# EAGLE design electrosteel2020_10_arrange7_synthboardsonlyrev6 (EAGLE 9.6.2)

## Sheet 1 of 2
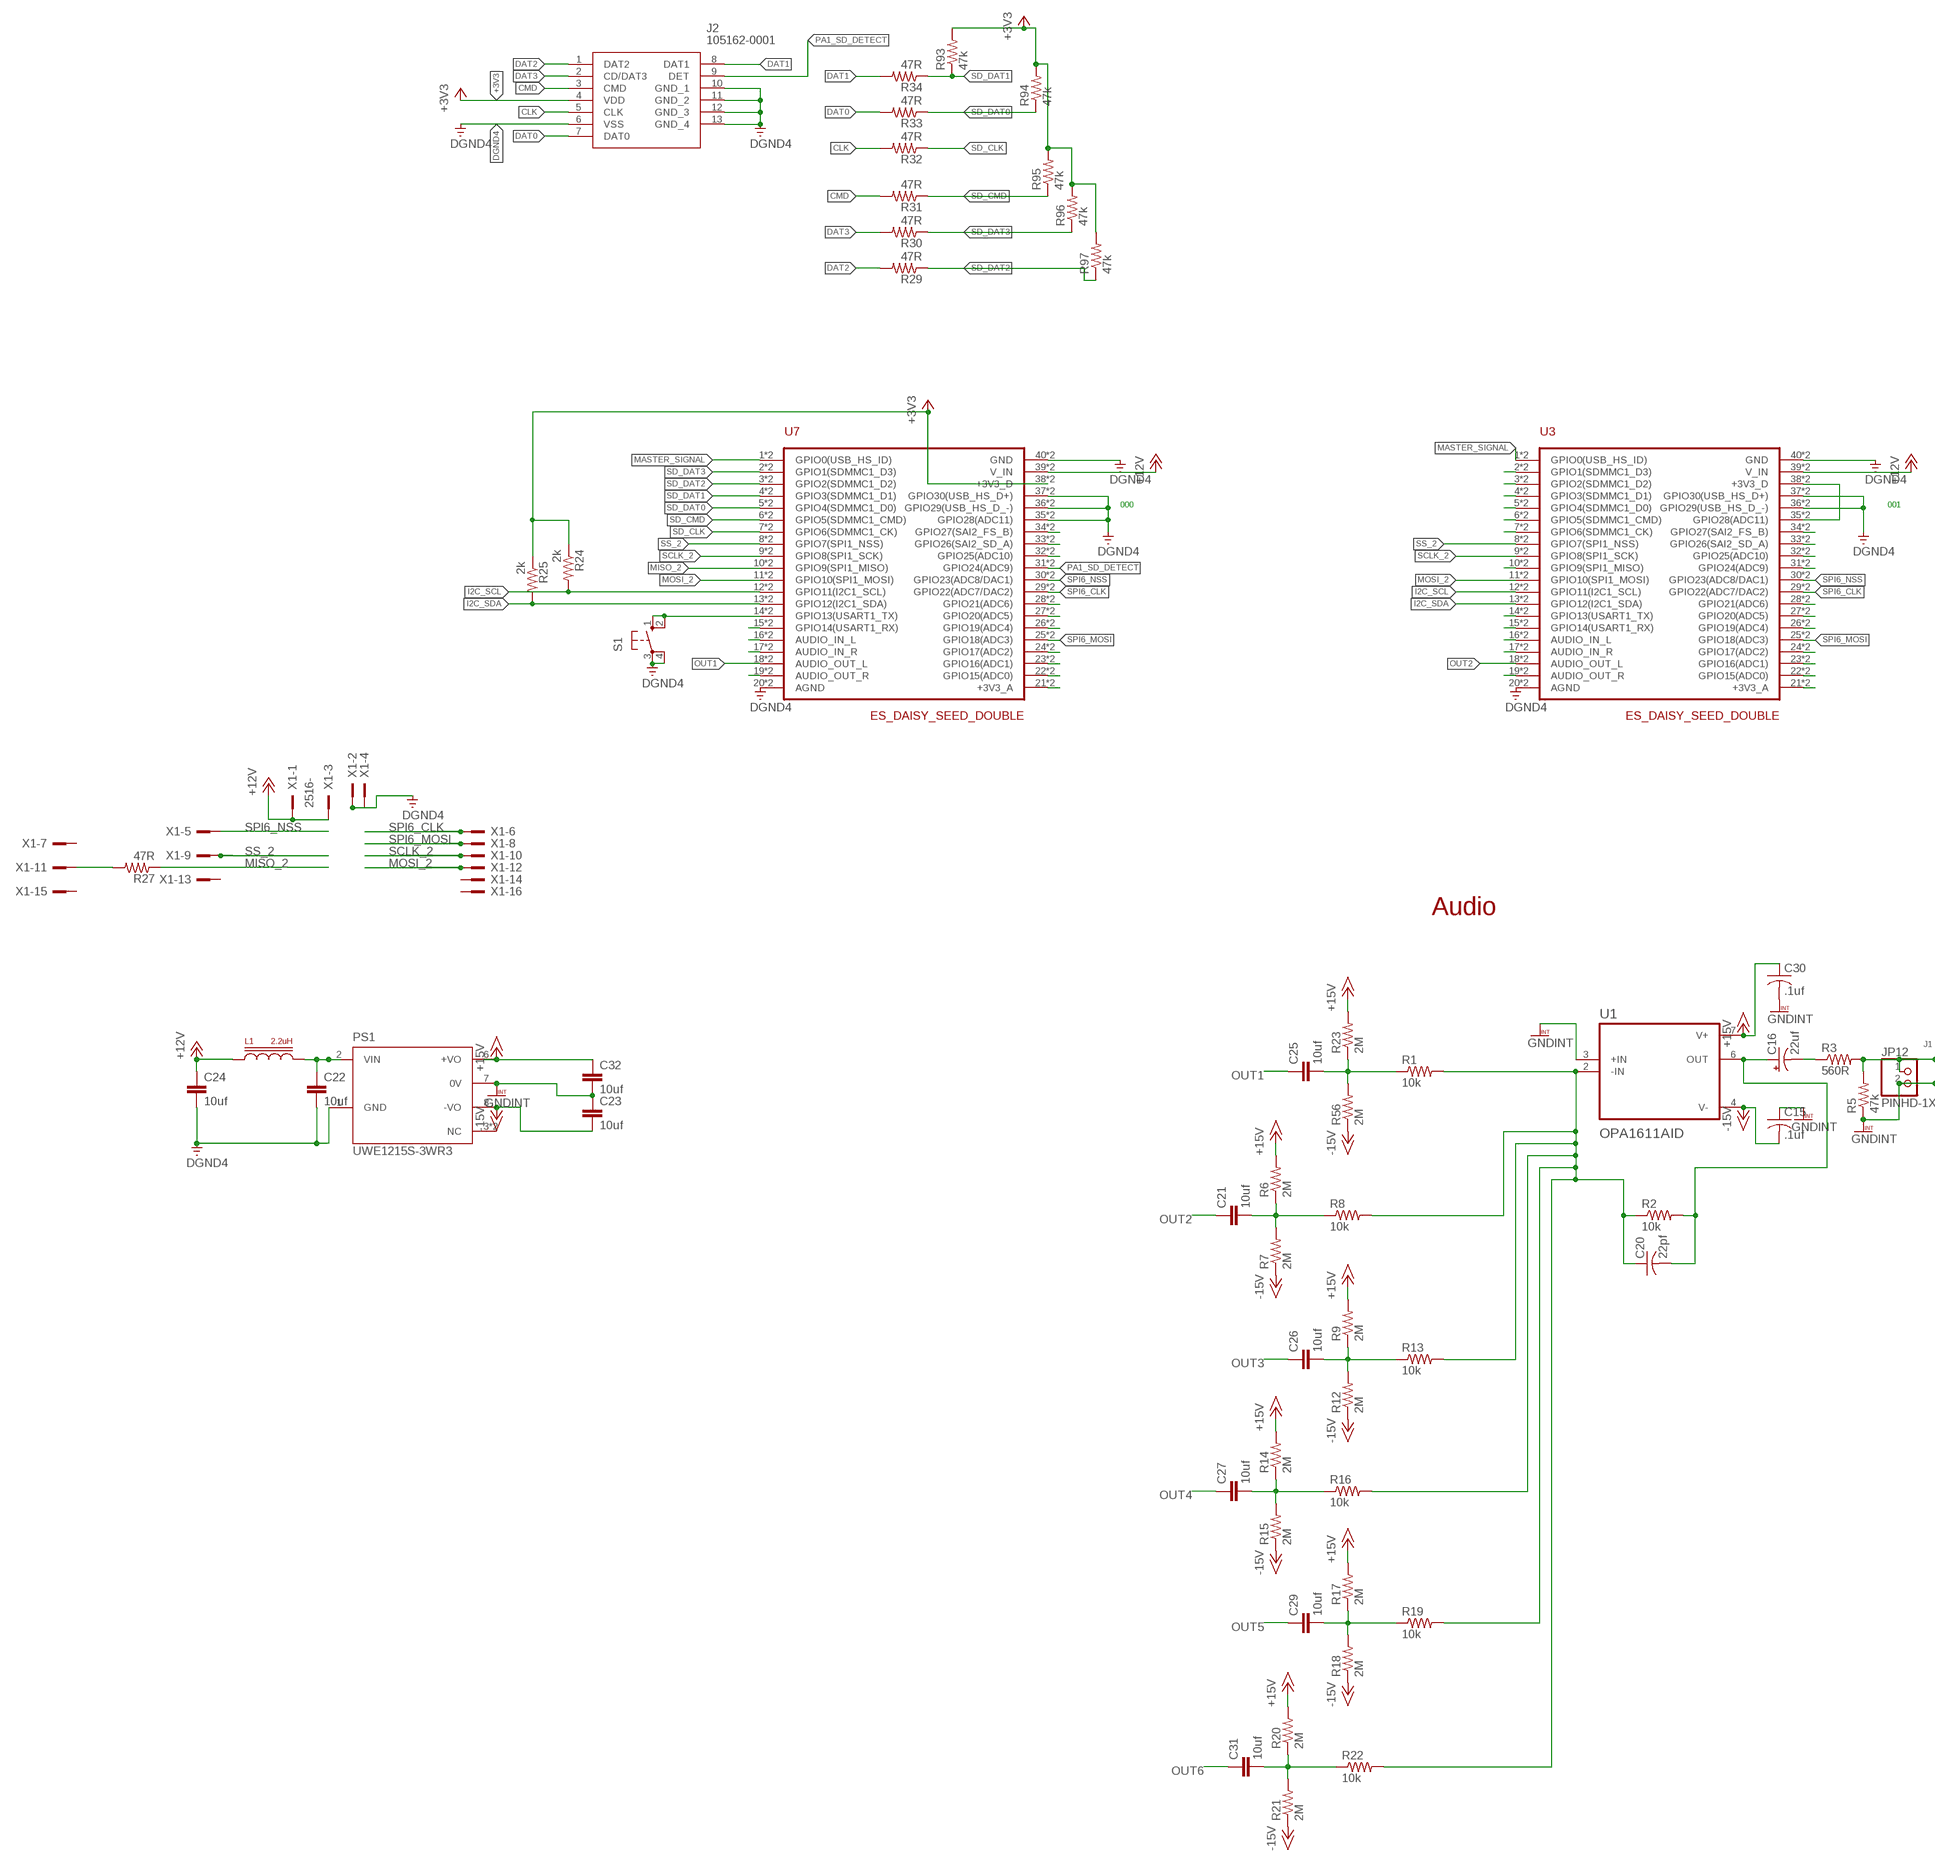
[diagram p0: schematic, sheet 1, part 1 of 3]
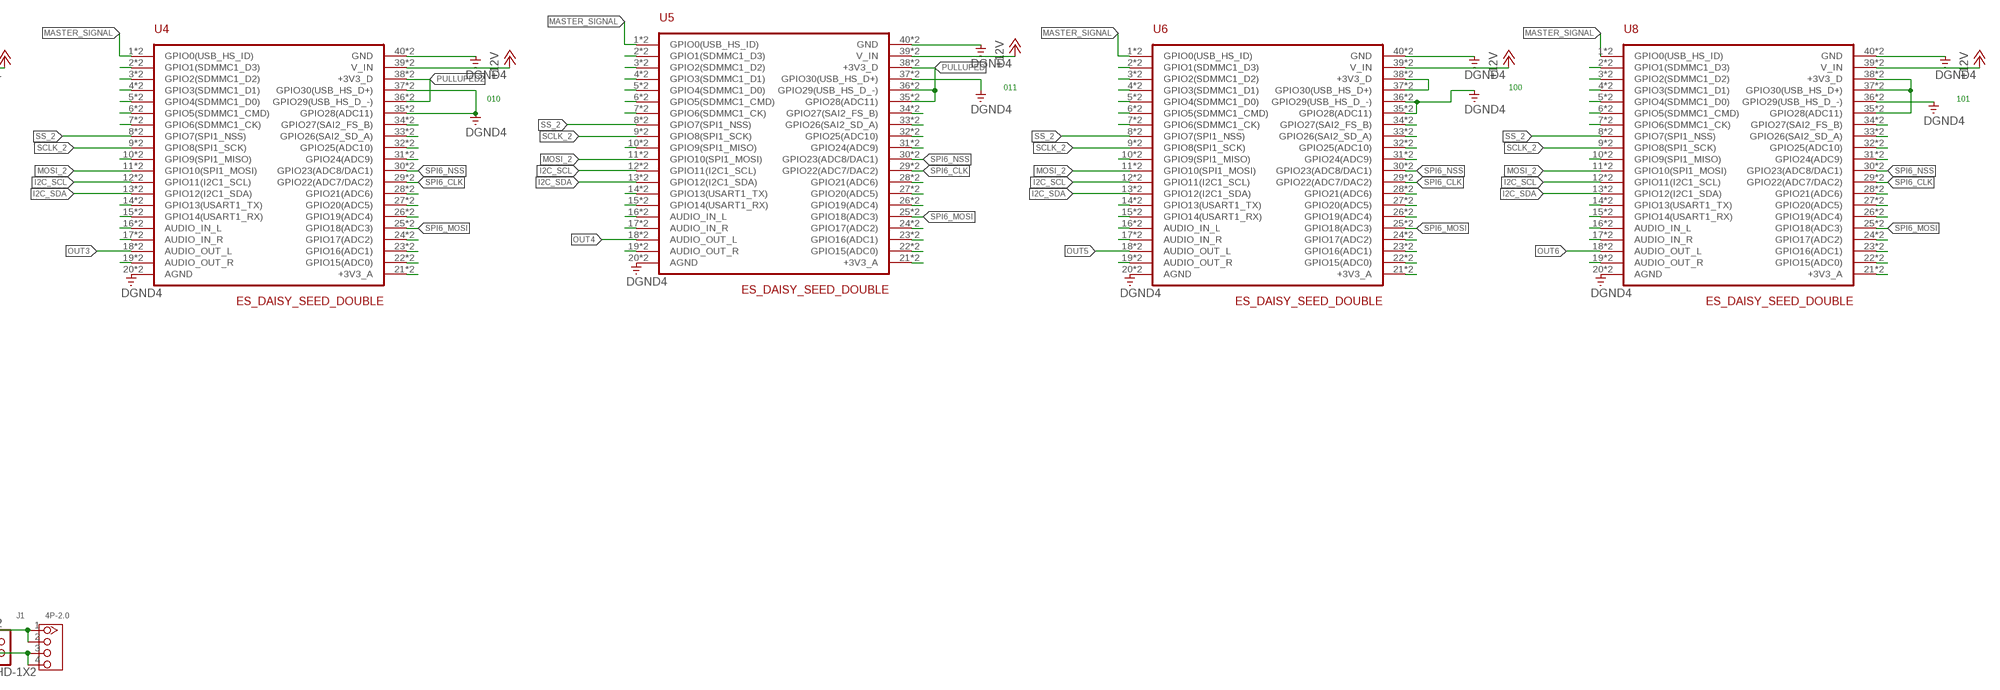
[diagram p1: schematic, sheet 1, part 2 of 3]
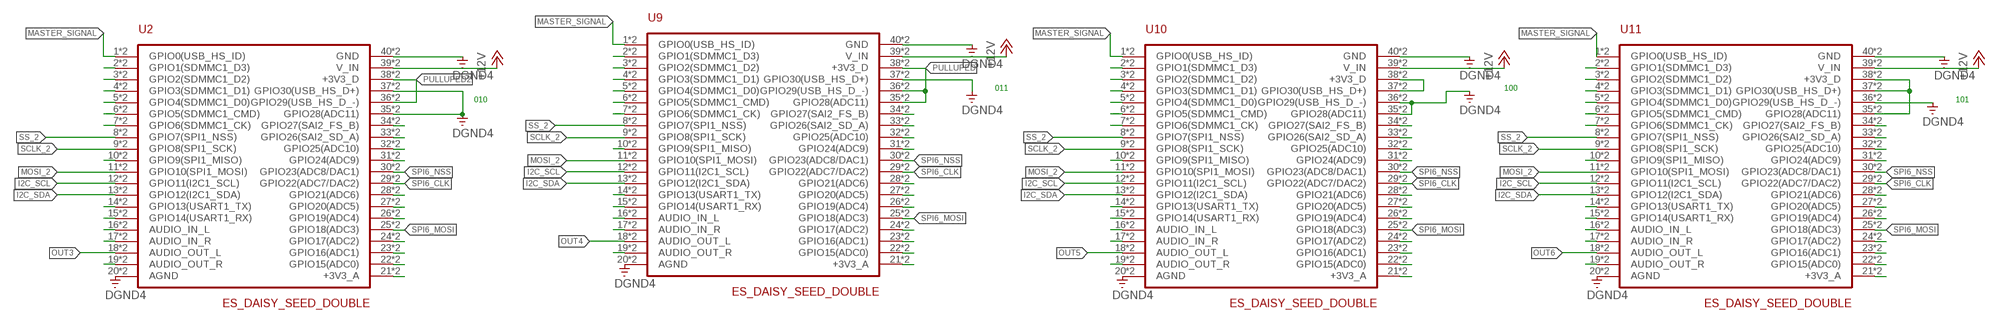
[diagram p2: schematic, sheet 1, part 3 of 3]

### Parts
C15  .1uf  C-USC0603K  [C0603K]
C16  22uf  CPOL-USD  [PANASONIC_D]
C20  22pf  C-USC0603  [C0603]
C21  10uf  C-EUC1206K  [C1206K]
C22  10uf  C-EUC1206K  [C1206K]
C23  10uf  C-EUC1206K  [C1206K]
C24  10uf  C-EUC1206K  [C1206K]
C25  10uf  C-EUC1206K  [C1206K]
C26  10uf  C-EUC1206K  [C1206K]
C27  10uf  C-EUC1206K  [C1206K]
C29  10uf  C-EUC1206K  [C1206K]
C30  .1uf  C-USC0603K  [C0603K]
C31  10uf  C-EUC1206K  [C1206K]
C32  10uf  C-EUC1206K  [C1206K]
J1  4P-2.0  GROVE-CONNECTOR-DIP(4P-2.0)  [HW4-2.0]
J2  105162-0001  [105162-0001]
JP12  PINHD-1X2  [1X02]
L1  2.2uH  INDUCTORS  [BOURNS_SRP2010]
PS1  UWE1215S-3WR3  [CONV_UWE1215S-3WR3]
R1  10k  R-US_R0603  [R0603]
R2  10k  R-US_R0603  [R0603]
R3  560R  R-US_R0603  [R0603]
R5  47k  R-US_R0603  [R0603]
R6  2M  R-US_R0603  [R0603]
R7  2M  R-US_R0603  [R0603]
R8  10k  R-US_R0603  [R0603]
R9  2M  R-US_R0603  [R0603]
R12  2M  R-US_R0603  [R0603]
R13  10k  R-US_R0603  [R0603]
R14  2M  R-US_R0603  [R0603]
R15  2M  R-US_R0603  [R0603]
R16  10k  R-US_R0603  [R0603]
R17  2M  R-US_R0603  [R0603]
R18  2M  R-US_R0603  [R0603]
R19  10k  R-US_R0603  [R0603]
R20  2M  R-US_R0603  [R0603]
R21  2M  R-US_R0603  [R0603]
R22  10k  R-US_R0603  [R0603]
R23  2M  R-US_R0603  [R0603]
R24  2k  R-US_R0603  [R0603]
R25  2k  R-US_R0603  [R0603]
R27  47R  R-US_R0603  [R0603]
R29  47R  R-US_R0603  [R0603]
R30  47R  R-US_R0603  [R0603]
R31  47R  R-US_R0603  [R0603]
R32  47R  R-US_R0603  [R0603]
R33  47R  R-US_R0603  [R0603]
R34  47R  R-US_R0603  [R0603]
R56  2M  R-US_R0603  [R0603]
R93  47k  R-US_R0603  [R0603]
R94  47k  R-US_R0603  [R0603]
R95  47k  R-US_R0603  [R0603]
R96  47k  R-US_R0603  [R0603]
R97  47k  R-US_R0603  [R0603]
S1  10-XX  [B3F-10XX]
U1  OPA1611AID  [SOIC127P599X175-8N]
U2  ES_DAISY_SEED_DOUBLE  [ES_DAISY_SEED_DOUBLE]
U3  ES_DAISY_SEED_DOUBLE  [ES_DAISY_SEED_DOUBLE]
U4  ES_DAISY_SEED_DOUBLE  [ES_DAISY_SEED_DOUBLE]
U5  ES_DAISY_SEED_DOUBLE  [ES_DAISY_SEED_DOUBLE]
U6  ES_DAISY_SEED_DOUBLE  [ES_DAISY_SEED_DOUBLE]
U7  ES_DAISY_SEED_DOUBLE  [ES_DAISY_SEED_DOUBLE]
U8  ES_DAISY_SEED_DOUBLE  [ES_DAISY_SEED_DOUBLE]
U9  ES_DAISY_SEED_DOUBLE  [ES_DAISY_SEED_DOUBLE]
U10  ES_DAISY_SEED_DOUBLE  [ES_DAISY_SEED_DOUBLE]
U11  ES_DAISY_SEED_DOUBLE  [ES_DAISY_SEED_DOUBLE]
X1  2516-  [PAK100/2500-16]

### Nets
+3V3: J2.4(VDD) R24.1 R25.1 R93.2 R94.2 R95.2 R96.2 R97.2 U7.38(+3V3_D) U7.B38(+3V3_D)
+12V: C24.1 L1.P$1 U2.39(V_IN) U2.B39(V_IN) U3.39(V_IN) U3.B39(V_IN) U4.39(V_IN) U4.B39(V_IN) U5.39(V_IN) U5.B39(V_IN) U6.39(V_IN) U6.B39(V_IN) U7.39(V_IN) U7.B39(V_IN) U8.39(V_IN) U8.B39(V_IN) U9.39(V_IN) U9.B39(V_IN) U10.39(V_IN) U10.B39(V_IN) U11.39(V_IN) U11.B39(V_IN) X1.1 X1.3
+15V: C30.1 C32.1 PS1.6(+VO) R6.2 R9.2 R14.2 R17.2 R20.2 R23.2 U1.7(V+)
-15V: C15.2 C23.2 PS1.8(-VO) R7.1 R12.1 R15.1 R18.1 R21.1 R56.1 U1.4(V-)
CLK: J2.5(CLK) R32.2
CMD: J2.3(CMD) R31.2
DAT0: J2.7(DAT0) R33.2
DAT1: J2.8(DAT1) R34.2
DAT2: J2.1(DAT2) R29.2
DAT3: J2.2(CD/DAT3) R30.2
DGND4: C22.2 C24.2 J2.6(VSS) J2.10(GND_1) J2.11(GND_2) J2.12(GND_3) J2.13(GND_4) PS1.1(GND) S1.3(P) S1.4(P1) U2.20(AGND) U2.35(GPIO28(ADC11)) U2.37(GPIO30(USB_HS_D+)) U2.40(GND) U2.B20(AGND) U2.B35(GPIO28(ADC11)) U2.B37(GPIO30(USB_HS_D+)) U2.B40(GND) U3.20(AGND) U3.36(GPIO29(USB_HS_D_-)) U3.37(GPIO30(USB_HS_D+)) U3.40(GND) U3.B20(AGND) U3.B36(GPIO29(USB_HS_D_-)) U3.B37(GPIO30(USB_HS_D+)) U3.B40(GND) U4.20(AGND) U4.35(GPIO28(ADC11)) U4.37(GPIO30(USB_HS_D+)) U4.40(GND) U4.B20(AGND) U4.B35(GPIO28(ADC11)) U4.B37(GPIO30(USB_HS_D+)) U4.B40(GND) U5.20(AGND) U5.37(GPIO30(USB_HS_D+)) U5.40(GND) U5.B20(AGND) U5.B37(GPIO30(USB_HS_D+)) U5.B40(GND) U6.20(AGND) U6.35(GPIO28(ADC11)) U6.36(GPIO29(USB_HS_D_-)) U6.40(GND) U6.B20(AGND) U6.B35(GPIO28(ADC11)) U6.B36(GPIO29(USB_HS_D_-)) U6.B40(GND) U7.20(AGND) U7.35(GPIO28(ADC11)) U7.36(GPIO29(USB_HS_D_-)) U7.37(GPIO30(USB_HS_D+)) U7.40(GND) U7.B20(AGND) U7.B35(GPIO28(ADC11)) U7.B36(GPIO29(USB_HS_D_-)) U7.B37(GPIO30(USB_HS_D+)) U7.B40(GND) U8.20(AGND) U8.36(GPIO29(USB_HS_D_-)) U8.40(GND) U8.B20(AGND) U8.B36(GPIO29(USB_HS_D_-)) U8.B40(GND) U9.20(AGND) U9.37(GPIO30(USB_HS_D+)) U9.40(GND) U9.B20(AGND) U9.B37(GPIO30(USB_HS_D+)) U9.B40(GND) U10.20(AGND) U10.35(GPIO28(ADC11)) U10.36(GPIO29(USB_HS_D_-)) U10.40(GND) U10.B20(AGND) U10.B35(GPIO28(ADC11)) U10.B36(GPIO29(USB_HS_D_-)) U10.B40(GND) U11.20(AGND) U11.36(GPIO29(USB_HS_D_-)) U11.40(GND) U11.B20(AGND) U11.B36(GPIO29(USB_HS_D_-)) U11.B40(GND) X1.2 X1.4
GNDINT: C15.1 C23.1 C30.2 C32.2 J1.3 J1.4 JP12.2 PS1.7(0V) R5.1 U1.3(+IN)
I2C_SCL: R24.2 U2.12(GPIO11(I2C1_SCL)) U2.B12(GPIO11(I2C1_SCL)) U3.12(GPIO11(I2C1_SCL)) U3.B12(GPIO11(I2C1_SCL)) U4.12(GPIO11(I2C1_SCL)) U4.B12(GPIO11(I2C1_SCL)) U5.12(GPIO11(I2C1_SCL)) U5.B12(GPIO11(I2C1_SCL)) U6.12(GPIO11(I2C1_SCL)) U6.B12(GPIO11(I2C1_SCL)) U7.12(GPIO11(I2C1_SCL)) U7.B12(GPIO11(I2C1_SCL)) U8.12(GPIO11(I2C1_SCL)) U8.B12(GPIO11(I2C1_SCL)) U9.12(GPIO11(I2C1_SCL)) U9.B12(GPIO11(I2C1_SCL)) U10.12(GPIO11(I2C1_SCL)) U10.B12(GPIO11(I2C1_SCL)) U11.12(GPIO11(I2C1_SCL)) U11.B12(GPIO11(I2C1_SCL))
I2C_SDA: R25.2 U2.13(GPIO12(I2C1_SDA)) U2.B13(GPIO12(I2C1_SDA)) U3.13(GPIO12(I2C1_SDA)) U3.B13(GPIO12(I2C1_SDA)) U4.13(GPIO12(I2C1_SDA)) U4.B13(GPIO12(I2C1_SDA)) U5.13(GPIO12(I2C1_SDA)) U5.B13(GPIO12(I2C1_SDA)) U6.13(GPIO12(I2C1_SDA)) U6.B13(GPIO12(I2C1_SDA)) U7.13(GPIO12(I2C1_SDA)) U7.B13(GPIO12(I2C1_SDA)) U8.13(GPIO12(I2C1_SDA)) U8.B13(GPIO12(I2C1_SDA)) U9.13(GPIO12(I2C1_SDA)) U9.B13(GPIO12(I2C1_SDA)) U10.13(GPIO12(I2C1_SDA)) U10.B13(GPIO12(I2C1_SDA)) U11.13(GPIO12(I2C1_SDA)) U11.B13(GPIO12(I2C1_SDA))
MASTER_SIGNAL: U2.1(GPIO0(USB_HS_ID)) U2.B1(GPIO0(USB_HS_ID)) U3.1(GPIO0(USB_HS_ID)) U3.B1(GPIO0(USB_HS_ID)) U4.1(GPIO0(USB_HS_ID)) U4.B1(GPIO0(USB_HS_ID)) U5.1(GPIO0(USB_HS_ID)) U5.B1(GPIO0(USB_HS_ID)) U6.1(GPIO0(USB_HS_ID)) U6.B1(GPIO0(USB_HS_ID)) U7.1(GPIO0(USB_HS_ID)) U7.B1(GPIO0(USB_HS_ID)) U8.1(GPIO0(USB_HS_ID)) U8.B1(GPIO0(USB_HS_ID)) U9.1(GPIO0(USB_HS_ID)) U9.B1(GPIO0(USB_HS_ID)) U10.1(GPIO0(USB_HS_ID)) U10.B1(GPIO0(USB_HS_ID)) U11.1(GPIO0(USB_HS_ID)) U11.B1(GPIO0(USB_HS_ID))
MISO_2: R27.1 U7.10(GPIO9(SPI1_MISO)) U7.B10(GPIO9(SPI1_MISO))
MISO_2_P1: U3.10(GPIO9(SPI1_MISO)) U3.B10(GPIO9(SPI1_MISO))
MISO_2_P2: U4.10(GPIO9(SPI1_MISO)) U4.B10(GPIO9(SPI1_MISO))
MISO_2_P3: U5.10(GPIO9(SPI1_MISO)) U5.B10(GPIO9(SPI1_MISO))
MISO_2_P4: U6.10(GPIO9(SPI1_MISO)) U6.B10(GPIO9(SPI1_MISO))
MISO_2_P5: U8.10(GPIO9(SPI1_MISO)) U8.B10(GPIO9(SPI1_MISO))
MISO_2_P6: U2.10(GPIO9(SPI1_MISO)) U2.B10(GPIO9(SPI1_MISO))
MISO_2_P7: U9.10(GPIO9(SPI1_MISO)) U9.B10(GPIO9(SPI1_MISO))
MISO_2_P8: U10.10(GPIO9(SPI1_MISO)) U10.B10(GPIO9(SPI1_MISO))
MISO_2_P9: U11.10(GPIO9(SPI1_MISO)) U11.B10(GPIO9(SPI1_MISO))
MONO_OUTPUT: C16.+ C20.2 R2.2 U1.6(OUT)
MOSI_2: U2.11(GPIO10(SPI1_MOSI)) U2.B11(GPIO10(SPI1_MOSI)) U3.11(GPIO10(SPI1_MOSI)) U3.B11(GPIO10(SPI1_MOSI)) U4.11(GPIO10(SPI1_MOSI)) U4.B11(GPIO10(SPI1_MOSI)) U5.11(GPIO10(SPI1_MOSI)) U5.B11(GPIO10(SPI1_MOSI)) U6.11(GPIO10(SPI1_MOSI)) U6.B11(GPIO10(SPI1_MOSI)) U7.11(GPIO10(SPI1_MOSI)) U7.B11(GPIO10(SPI1_MOSI)) U8.11(GPIO10(SPI1_MOSI)) U8.B11(GPIO10(SPI1_MOSI)) U9.11(GPIO10(SPI1_MOSI)) U9.B11(GPIO10(SPI1_MOSI)) U10.11(GPIO10(SPI1_MOSI)) U10.B11(GPIO10(SPI1_MOSI)) U11.11(GPIO10(SPI1_MOSI)) U11.B11(GPIO10(SPI1_MOSI)) X1.12
N$1: U5.31(GPIO24(ADC9)) U5.B31(GPIO24(ADC9))
N$2: C21.2 R6.1 R7.2 R8.1
N$3: U6.31(GPIO24(ADC9)) U6.B31(GPIO24(ADC9))
N$4: C20.1 R1.2 R2.1 R8.2 R13.2 R16.2 R19.2 R22.2 U1.2(-IN)
N$5: C16.- R3.1
N$6: J1.1 J1.2 JP12.1 R3.2 R5.2
N$7: C25.2 R1.1 R23.1 R56.2
N$8: C26.2 R9.1 R12.2 R13.1
N$9: C27.2 R14.1 R15.2 R16.1
N$10: C29.2 R17.1 R18.2 R19.1
N$11: C31.2 R20.1 R21.2 R22.1
N$12: U7.19(AUDIO_OUT_R) U7.B19(AUDIO_OUT_R)
N$13: U7.17(AUDIO_IN_R) U7.B17(AUDIO_IN_R)
N$14: U7.16(AUDIO_IN_L) U7.B16(AUDIO_IN_L)
N$15: U7.15(GPIO14(USART1_RX)) U7.B15(GPIO14(USART1_RX))
N$16: U2.21(+3V3_A) U2.B21(+3V3_A)
N$17: U8.31(GPIO24(ADC9)) U8.B31(GPIO24(ADC9))
N$18: U8.26(GPIO19(ADC4)) U8.B26(GPIO19(ADC4))
N$19: U6.26(GPIO19(ADC4)) U6.B26(GPIO19(ADC4))
N$20: U7.34(GPIO27(SAI2_FS_B)) U7.B34(GPIO27(SAI2_FS_B))
N$21: U7.33(GPIO26(SAI2_SD_A)) U7.B33(GPIO26(SAI2_SD_A))
N$22: U7.32(GPIO25(ADC10)) U7.B32(GPIO25(ADC10))
N$23: U5.26(GPIO19(ADC4)) U5.B26(GPIO19(ADC4))
N$24: R27.2 X1.11
N$25: U7.28(GPIO21(ADC6)) U7.B28(GPIO21(ADC6))
N$26: U7.27(GPIO20(ADC5)) U7.B27(GPIO20(ADC5))
N$27: U4.26(GPIO19(ADC4)) U4.B26(GPIO19(ADC4))
N$28: U3.26(GPIO19(ADC4)) U3.B26(GPIO19(ADC4))
N$29: U3.21(+3V3_A) U3.B21(+3V3_A)
N$30: U7.24(GPIO17(ADC2)) U7.B24(GPIO17(ADC2))
N$31: U7.23(GPIO16(ADC1)) U7.B23(GPIO16(ADC1))
N$32: U7.22(GPIO15(ADC0)) U7.B22(GPIO15(ADC0))
N$33: U3.19(AUDIO_OUT_R) U3.B19(AUDIO_OUT_R)
N$34: U3.17(AUDIO_IN_R) U3.B17(AUDIO_IN_R)
N$35: U3.16(AUDIO_IN_L) U3.B16(AUDIO_IN_L)
N$36: U3.15(GPIO14(USART1_RX)) U3.B15(GPIO14(USART1_RX))
N$37: U3.14(GPIO13(USART1_TX)) U3.B14(GPIO13(USART1_TX))
N$38: U7.26(GPIO19(ADC4)) U7.B26(GPIO19(ADC4))
N$39: U3.35(GPIO28(ADC11)) U3.38(+3V3_D) U3.B35(GPIO28(ADC11)) U3.B38(+3V3_D)
N$40: U3.34(GPIO27(SAI2_FS_B)) U3.B34(GPIO27(SAI2_FS_B))
N$41: U3.33(GPIO26(SAI2_SD_A)) U3.B33(GPIO26(SAI2_SD_A))
N$42: U3.32(GPIO25(ADC10)) U3.B32(GPIO25(ADC10))
N$43: U3.28(GPIO21(ADC6)) U3.B28(GPIO21(ADC6))
N$44: U3.27(GPIO20(ADC5)) U3.B27(GPIO20(ADC5))
N$45: U7.21(+3V3_A) U7.B21(+3V3_A)
N$46: U3.24(GPIO17(ADC2)) U3.B24(GPIO17(ADC2))
N$47: U3.23(GPIO16(ADC1)) U3.B23(GPIO16(ADC1))
N$48: U3.22(GPIO15(ADC0)) U3.B22(GPIO15(ADC0))
N$49: U4.21(+3V3_A) U4.B21(+3V3_A)
N$50: U4.19(AUDIO_OUT_R) U4.B19(AUDIO_OUT_R)
N$51: U4.17(AUDIO_IN_R) U4.B17(AUDIO_IN_R)
N$52: U4.16(AUDIO_IN_L) U4.B16(AUDIO_IN_L)
N$53: U4.15(GPIO14(USART1_RX)) U4.B15(GPIO14(USART1_RX))
N$54: U4.14(GPIO13(USART1_TX)) U4.B14(GPIO13(USART1_TX))
N$55: S1.1(S) S1.2(S1) U7.14(GPIO13(USART1_TX)) U7.B14(GPIO13(USART1_TX))
N$56: U3.2(GPIO1(SDMMC1_D3)) U3.B2(GPIO1(SDMMC1_D3))
N$57: U4.34(GPIO27(SAI2_FS_B)) U4.B34(GPIO27(SAI2_FS_B))
N$58: U4.33(GPIO26(SAI2_SD_A)) U4.B33(GPIO26(SAI2_SD_A))
N$59: U4.32(GPIO25(ADC10)) U4.B32(GPIO25(ADC10))
N$60: U4.28(GPIO21(ADC6)) U4.B28(GPIO21(ADC6))
N$61: U4.27(GPIO20(ADC5)) U4.B27(GPIO20(ADC5))
N$62: U4.24(GPIO17(ADC2)) U4.B24(GPIO17(ADC2))
N$63: U4.23(GPIO16(ADC1)) U4.B23(GPIO16(ADC1))
N$64: U4.22(GPIO15(ADC0)) U4.B22(GPIO15(ADC0))
N$65: U5.21(+3V3_A) U5.B21(+3V3_A)
N$66: U5.19(AUDIO_OUT_R) U5.B19(AUDIO_OUT_R)
N$67: U5.17(AUDIO_IN_R) U5.B17(AUDIO_IN_R)
N$68: U5.16(AUDIO_IN_L) U5.B16(AUDIO_IN_L)
N$69: U5.15(GPIO14(USART1_RX)) U5.B15(GPIO14(USART1_RX))
N$70: U5.14(GPIO13(USART1_TX)) U5.B14(GPIO13(USART1_TX))
N$71: U3.3(GPIO2(SDMMC1_D2)) U3.B3(GPIO2(SDMMC1_D2))
N$72: U3.4(GPIO3(SDMMC1_D1)) U3.B4(GPIO3(SDMMC1_D1))
N$73: U5.34(GPIO27(SAI2_FS_B)) U5.B34(GPIO27(SAI2_FS_B))
N$74: U5.33(GPIO26(SAI2_SD_A)) U5.B33(GPIO26(SAI2_SD_A))
N$75: U5.32(GPIO25(ADC10)) U5.B32(GPIO25(ADC10))
N$76: U5.28(GPIO21(ADC6)) U5.B28(GPIO21(ADC6))
N$77: U5.27(GPIO20(ADC5)) U5.B27(GPIO20(ADC5))
N$78: U5.24(GPIO17(ADC2)) U5.B24(GPIO17(ADC2))
N$79: U5.23(GPIO16(ADC1)) U5.B23(GPIO16(ADC1))
N$80: U5.22(GPIO15(ADC0)) U5.B22(GPIO15(ADC0))
N$81: C22.1 L1.P$2 PS1.2(VIN)
N$82: U6.21(+3V3_A) U6.B21(+3V3_A)
N$83: U6.19(AUDIO_OUT_R) U6.B19(AUDIO_OUT_R)
N$84: U6.17(AUDIO_IN_R) U6.B17(AUDIO_IN_R)
N$85: U6.16(AUDIO_IN_L) U6.B16(AUDIO_IN_L)
N$86: U6.15(GPIO14(USART1_RX)) U6.B15(GPIO14(USART1_RX))
N$87: U6.14(GPIO13(USART1_TX)) U6.B14(GPIO13(USART1_TX))
N$88: U6.37(GPIO30(USB_HS_D+)) U6.38(+3V3_D) U6.B37(GPIO30(USB_HS_D+)) U6.B38(+3V3_D)
N$89: U3.5(GPIO4(SDMMC1_D0)) U3.B5(GPIO4(SDMMC1_D0))
N$90: U6.34(GPIO27(SAI2_FS_B)) U6.B34(GPIO27(SAI2_FS_B))
N$91: U6.33(GPIO26(SAI2_SD_A)) U6.B33(GPIO26(SAI2_SD_A))
N$92: U6.32(GPIO25(ADC10)) U6.B32(GPIO25(ADC10))
N$93: U6.28(GPIO21(ADC6)) U6.B28(GPIO21(ADC6))
N$94: U6.27(GPIO20(ADC5)) U6.B27(GPIO20(ADC5))
N$95: U6.24(GPIO17(ADC2)) U6.B24(GPIO17(ADC2))
N$96: U6.23(GPIO16(ADC1)) U6.B23(GPIO16(ADC1))
N$97: U6.22(GPIO15(ADC0)) U6.B22(GPIO15(ADC0))
N$98: U8.21(+3V3_A) U8.B21(+3V3_A)
N$99: U8.19(AUDIO_OUT_R) U8.B19(AUDIO_OUT_R)
N$100: U8.17(AUDIO_IN_R) U8.B17(AUDIO_IN_R)
N$101: U8.16(AUDIO_IN_L) U8.B16(AUDIO_IN_L)
N$102: U8.15(GPIO14(USART1_RX)) U8.B15(GPIO14(USART1_RX))
N$103: U8.14(GPIO13(USART1_TX)) U8.B14(GPIO13(USART1_TX))
N$104: U8.35(GPIO28(ADC11)) U8.37(GPIO30(USB_HS_D+)) U8.38(+3V3_D) U8.B35(GPIO28(ADC11)) U8.B37(GPIO30(USB_HS_D+)) U8.B38(+3V3_D)
N$105: U3.6(GPIO5(SDMMC1_CMD)) U3.B6(GPIO5(SDMMC1_CMD))
N$106: U3.7(GPIO6(SDMMC1_CK)) U3.B7(GPIO6(SDMMC1_CK))
N$107: U2.19(AUDIO_OUT_R) U2.B19(AUDIO_OUT_R)
N$108: U8.34(GPIO27(SAI2_FS_B)) U8.B34(GPIO27(SAI2_FS_B))
N$109: U8.33(GPIO26(SAI2_SD_A)) U8.B33(GPIO26(SAI2_SD_A))
N$110: U8.32(GPIO25(ADC10)) U8.B32(GPIO25(ADC10))
N$111: U8.28(GPIO21(ADC6)) U8.B28(GPIO21(ADC6))
N$112: U8.27(GPIO20(ADC5)) U8.B27(GPIO20(ADC5))
N$113: U8.24(GPIO17(ADC2)) U8.B24(GPIO17(ADC2))
N$114: U8.23(GPIO16(ADC1)) U8.B23(GPIO16(ADC1))
N$115: U8.22(GPIO15(ADC0)) U8.B22(GPIO15(ADC0))
N$116: U4.2(GPIO1(SDMMC1_D3)) U4.B2(GPIO1(SDMMC1_D3))
N$117: U4.3(GPIO2(SDMMC1_D2)) U4.B3(GPIO2(SDMMC1_D2))
N$118: U4.4(GPIO3(SDMMC1_D1)) U4.B4(GPIO3(SDMMC1_D1))
N$119: U4.5(GPIO4(SDMMC1_D0)) U4.B5(GPIO4(SDMMC1_D0))
N$120: U4.6(GPIO5(SDMMC1_CMD)) U4.B6(GPIO5(SDMMC1_CMD))
N$121: U4.7(GPIO6(SDMMC1_CK)) U4.B7(GPIO6(SDMMC1_CK))
N$122: U2.17(AUDIO_IN_R) U2.B17(AUDIO_IN_R)
N$123: U5.2(GPIO1(SDMMC1_D3)) U5.B2(GPIO1(SDMMC1_D3))
N$124: U5.3(GPIO2(SDMMC1_D2)) U5.B3(GPIO2(SDMMC1_D2))
N$125: U5.4(GPIO3(SDMMC1_D1)) U5.B4(GPIO3(SDMMC1_D1))
N$126: U5.5(GPIO4(SDMMC1_D0)) U5.B5(GPIO4(SDMMC1_D0))
N$127: U5.6(GPIO5(SDMMC1_CMD)) U5.B6(GPIO5(SDMMC1_CMD))
N$128: U5.7(GPIO6(SDMMC1_CK)) U5.B7(GPIO6(SDMMC1_CK))
N$129: U2.16(AUDIO_IN_L) U2.B16(AUDIO_IN_L)
N$130: U6.2(GPIO1(SDMMC1_D3)) U6.B2(GPIO1(SDMMC1_D3))
N$131: U6.3(GPIO2(SDMMC1_D2)) U6.B3(GPIO2(SDMMC1_D2))
N$132: U6.4(GPIO3(SDMMC1_D1)) U6.B4(GPIO3(SDMMC1_D1))
N$133: U6.5(GPIO4(SDMMC1_D0)) U6.B5(GPIO4(SDMMC1_D0))
N$134: U6.6(GPIO5(SDMMC1_CMD)) U6.B6(GPIO5(SDMMC1_CMD))
N$135: U6.7(GPIO6(SDMMC1_CK)) U6.B7(GPIO6(SDMMC1_CK))
N$136: U8.2(GPIO1(SDMMC1_D3)) U8.B2(GPIO1(SDMMC1_D3))
N$137: U8.3(GPIO2(SDMMC1_D2)) U8.B3(GPIO2(SDMMC1_D2))
N$138: U8.4(GPIO3(SDMMC1_D1)) U8.B4(GPIO3(SDMMC1_D1))
N$139: U8.5(GPIO4(SDMMC1_D0)) U8.B5(GPIO4(SDMMC1_D0))
N$140: U8.6(GPIO5(SDMMC1_CMD)) U8.B6(GPIO5(SDMMC1_CMD))
N$141: U8.7(GPIO6(SDMMC1_CK)) U8.B7(GPIO6(SDMMC1_CK))
N$142: U2.15(GPIO14(USART1_RX)) U2.B15(GPIO14(USART1_RX))
N$143: U2.14(GPIO13(USART1_TX)) U2.B14(GPIO13(USART1_TX))
N$144: U2.34(GPIO27(SAI2_FS_B)) U2.B34(GPIO27(SAI2_FS_B))
N$145: U2.33(GPIO26(SAI2_SD_A)) U2.B33(GPIO26(SAI2_SD_A))
N$146: U2.32(GPIO25(ADC10)) U2.B32(GPIO25(ADC10))
N$147: U2.28(GPIO21(ADC6)) U2.B28(GPIO21(ADC6))
N$148: U2.27(GPIO20(ADC5)) U2.B27(GPIO20(ADC5))
N$149: U2.24(GPIO17(ADC2)) U2.B24(GPIO17(ADC2))
N$150: U2.23(GPIO16(ADC1)) U2.B23(GPIO16(ADC1))
N$151: U2.22(GPIO15(ADC0)) U2.B22(GPIO15(ADC0))
N$152: U9.21(+3V3_A) U9.B21(+3V3_A)
N$153: U9.19(AUDIO_OUT_R) U9.B19(AUDIO_OUT_R)
N$154: U9.17(AUDIO_IN_R) U9.B17(AUDIO_IN_R)
N$155: U9.16(AUDIO_IN_L) U9.B16(AUDIO_IN_L)
N$156: U9.15(GPIO14(USART1_RX)) U9.B15(GPIO14(USART1_RX))
N$157: U9.14(GPIO13(USART1_TX)) U9.B14(GPIO13(USART1_TX))
N$158: U9.34(GPIO27(SAI2_FS_B)) U9.B34(GPIO27(SAI2_FS_B))
N$159: U9.33(GPIO26(SAI2_SD_A)) U9.B33(GPIO26(SAI2_SD_A))
N$160: U9.32(GPIO25(ADC10)) U9.B32(GPIO25(ADC10))
N$161: U9.28(GPIO21(ADC6)) U9.B28(GPIO21(ADC6))
N$162: U9.27(GPIO20(ADC5)) U9.B27(GPIO20(ADC5))
N$163: U9.24(GPIO17(ADC2)) U9.B24(GPIO17(ADC2))
N$164: U9.23(GPIO16(ADC1)) U9.B23(GPIO16(ADC1))
N$165: U9.22(GPIO15(ADC0)) U9.B22(GPIO15(ADC0))
N$166: U10.21(+3V3_A) U10.B21(+3V3_A)
N$167: U10.19(AUDIO_OUT_R) U10.B19(AUDIO_OUT_R)
N$168: U10.17(AUDIO_IN_R) U10.B17(AUDIO_IN_R)
N$169: U10.16(AUDIO_IN_L) U10.B16(AUDIO_IN_L)
N$170: U10.15(GPIO14(USART1_RX)) U10.B15(GPIO14(USART1_RX))
N$171: U10.14(GPIO13(USART1_TX)) U10.B14(GPIO13(USART1_TX))
N$172: U10.37(GPIO30(USB_HS_D+)) U10.38(+3V3_D) U10.B37(GPIO30(USB_HS_D+)) U10.B38(+3V3_D)
N$173: U10.34(GPIO27(SAI2_FS_B)) U10.B34(GPIO27(SAI2_FS_B))
N$174: U10.33(GPIO26(SAI2_SD_A)) U10.B33(GPIO26(SAI2_SD_A))
N$175: U10.32(GPIO25(ADC10)) U10.B32(GPIO25(ADC10))
N$176: U10.28(GPIO21(ADC6)) U10.B28(GPIO21(ADC6))
N$177: U10.27(GPIO20(ADC5)) U10.B27(GPIO20(ADC5))
N$178: U10.24(GPIO17(ADC2)) U10.B24(GPIO17(ADC2))
N$179: U10.23(GPIO16(ADC1)) U10.B23(GPIO16(ADC1))
N$180: U10.22(GPIO15(ADC0)) U10.B22(GPIO15(ADC0))
N$181: U11.21(+3V3_A) U11.B21(+3V3_A)
N$182: U11.19(AUDIO_OUT_R) U11.B19(AUDIO_OUT_R)
N$183: U11.17(AUDIO_IN_R) U11.B17(AUDIO_IN_R)
N$184: U11.16(AUDIO_IN_L) U11.B16(AUDIO_IN_L)
N$185: U11.15(GPIO14(USART1_RX)) U11.B15(GPIO14(USART1_RX))
N$186: U11.14(GPIO13(USART1_TX)) U11.B14(GPIO13(USART1_TX))
N$187: U11.35(GPIO28(ADC11)) U11.37(GPIO30(USB_HS_D+)) U11.38(+3V3_D) U11.B35(GPIO28(ADC11)) U11.B37(GPIO30(USB_HS_D+)) U11.B38(+3V3_D)
N$188: U11.34(GPIO27(SAI2_FS_B)) U11.B34(GPIO27(SAI2_FS_B))
N$189: U11.33(GPIO26(SAI2_SD_A)) U11.B33(GPIO26(SAI2_SD_A))
N$190: U11.32(GPIO25(ADC10)) U11.B32(GPIO25(ADC10))
N$191: U11.28(GPIO21(ADC6)) U11.B28(GPIO21(ADC6))
N$192: U11.27(GPIO20(ADC5)) U11.B27(GPIO20(ADC5))
N$193: U11.24(GPIO17(ADC2)) U11.B24(GPIO17(ADC2))
N$194: U11.23(GPIO16(ADC1)) U11.B23(GPIO16(ADC1))
N$195: U11.22(GPIO15(ADC0)) U11.B22(GPIO15(ADC0))
N$196: U9.31(GPIO24(ADC9)) U9.B31(GPIO24(ADC9))
N$197: U10.31(GPIO24(ADC9)) U10.B31(GPIO24(ADC9))
N$198: U11.31(GPIO24(ADC9)) U11.B31(GPIO24(ADC9))
N$199: U11.26(GPIO19(ADC4)) U11.B26(GPIO19(ADC4))
N$200: U10.26(GPIO19(ADC4)) U10.B26(GPIO19(ADC4))
N$201: U9.26(GPIO19(ADC4)) U9.B26(GPIO19(ADC4))
N$202: U2.26(GPIO19(ADC4)) U2.B26(GPIO19(ADC4))
N$203: U2.2(GPIO1(SDMMC1_D3)) U2.B2(GPIO1(SDMMC1_D3))
N$204: U2.3(GPIO2(SDMMC1_D2)) U2.B3(GPIO2(SDMMC1_D2))
N$205: U2.4(GPIO3(SDMMC1_D1)) U2.B4(GPIO3(SDMMC1_D1))
N$206: U2.5(GPIO4(SDMMC1_D0)) U2.B5(GPIO4(SDMMC1_D0))
N$207: U2.6(GPIO5(SDMMC1_CMD)) U2.B6(GPIO5(SDMMC1_CMD))
N$208: U2.7(GPIO6(SDMMC1_CK)) U2.B7(GPIO6(SDMMC1_CK))
N$209: U9.2(GPIO1(SDMMC1_D3)) U9.B2(GPIO1(SDMMC1_D3))
N$210: U9.3(GPIO2(SDMMC1_D2)) U9.B3(GPIO2(SDMMC1_D2))
N$211: U9.4(GPIO3(SDMMC1_D1)) U9.B4(GPIO3(SDMMC1_D1))
N$212: U9.5(GPIO4(SDMMC1_D0)) U9.B5(GPIO4(SDMMC1_D0))
N$213: U9.6(GPIO5(SDMMC1_CMD)) U9.B6(GPIO5(SDMMC1_CMD))
N$214: U9.7(GPIO6(SDMMC1_CK)) U9.B7(GPIO6(SDMMC1_CK))
N$215: U10.2(GPIO1(SDMMC1_D3)) U10.B2(GPIO1(SDMMC1_D3))
N$216: U10.3(GPIO2(SDMMC1_D2)) U10.B3(GPIO2(SDMMC1_D2))
N$217: U10.4(GPIO3(SDMMC1_D1)) U10.B4(GPIO3(SDMMC1_D1))
N$218: U10.5(GPIO4(SDMMC1_D0)) U10.B5(GPIO4(SDMMC1_D0))
N$219: U10.6(GPIO5(SDMMC1_CMD)) U10.B6(GPIO5(SDMMC1_CMD))
N$220: U10.7(GPIO6(SDMMC1_CK)) U10.B7(GPIO6(SDMMC1_CK))
N$221: U11.2(GPIO1(SDMMC1_D3)) U11.B2(GPIO1(SDMMC1_D3))
N$222: U11.3(GPIO2(SDMMC1_D2)) U11.B3(GPIO2(SDMMC1_D2))
N$223: U11.4(GPIO3(SDMMC1_D1)) U11.B4(GPIO3(SDMMC1_D1))
N$224: U11.5(GPIO4(SDMMC1_D0)) U11.B5(GPIO4(SDMMC1_D0))
N$225: U11.6(GPIO5(SDMMC1_CMD)) U11.B6(GPIO5(SDMMC1_CMD))
N$226: U11.7(GPIO6(SDMMC1_CK)) U11.B7(GPIO6(SDMMC1_CK))
OUT1: C25.1 U7.18(AUDIO_OUT_L) U7.B18(AUDIO_OUT_L)
OUT2: C21.1 U3.18(AUDIO_OUT_L) U3.B18(AUDIO_OUT_L)
OUT3: C26.1 U2.18(AUDIO_OUT_L) U2.B18(AUDIO_OUT_L) U4.18(AUDIO_OUT_L) U4.B18(AUDIO_OUT_L)
OUT4: C27.1 U5.18(AUDIO_OUT_L) U5.B18(AUDIO_OUT_L) U9.18(AUDIO_OUT_L) U9.B18(AUDIO_OUT_L)
OUT5: C29.1 U6.18(AUDIO_OUT_L) U6.B18(AUDIO_OUT_L) U10.18(AUDIO_OUT_L) U10.B18(AUDIO_OUT_L)
OUT6: C31.1 U8.18(AUDIO_OUT_L) U8.B18(AUDIO_OUT_L) U11.18(AUDIO_OUT_L) U11.B18(AUDIO_OUT_L)
PA1_SD_DETECT: J2.9(DET) U3.31(GPIO24(ADC9)) U3.B31(GPIO24(ADC9)) U7.31(GPIO24(ADC9)) U7.B31(GPIO24(ADC9))
PA1_SD_DETECT1: U4.31(GPIO24(ADC9)) U4.B31(GPIO24(ADC9))
PA1_SD_DETECT2: U2.31(GPIO24(ADC9)) U2.B31(GPIO24(ADC9))
PULLUPED: U5.35(GPIO28(ADC11)) U5.36(GPIO29(USB_HS_D_-)) U5.38(+3V3_D) U5.B35(GPIO28(ADC11)) U5.B36(GPIO29(USB_HS_D_-)) U5.B38(+3V3_D) U9.35(GPIO28(ADC11)) U9.36(GPIO29(USB_HS_D_-)) U9.38(+3V3_D) U9.B35(GPIO28(ADC11)) U9.B36(GPIO29(USB_HS_D_-)) U9.B38(+3V3_D)
PULLUPED2: U2.36(GPIO29(USB_HS_D_-)) U2.38(+3V3_D) U2.B36(GPIO29(USB_HS_D_-)) U2.B38(+3V3_D) U4.36(GPIO29(USB_HS_D_-)) U4.38(+3V3_D) U4.B36(GPIO29(USB_HS_D_-)) U4.B38(+3V3_D)
SCLK_2: U2.9(GPIO8(SPI1_SCK)) U2.B9(GPIO8(SPI1_SCK)) U3.9(GPIO8(SPI1_SCK)) U3.B9(GPIO8(SPI1_SCK)) U4.9(GPIO8(SPI1_SCK)) U4.B9(GPIO8(SPI1_SCK)) U5.9(GPIO8(SPI1_SCK)) U5.B9(GPIO8(SPI1_SCK)) U6.9(GPIO8(SPI1_SCK)) U6.B9(GPIO8(SPI1_SCK)) U7.9(GPIO8(SPI1_SCK)) U7.B9(GPIO8(SPI1_SCK)) U8.9(GPIO8(SPI1_SCK)) U8.B9(GPIO8(SPI1_SCK)) U9.9(GPIO8(SPI1_SCK)) U9.B9(GPIO8(SPI1_SCK)) U10.9(GPIO8(SPI1_SCK)) U10.B9(GPIO8(SPI1_SCK)) U11.9(GPIO8(SPI1_SCK)) U11.B9(GPIO8(SPI1_SCK)) X1.10
SD_CLK: R32.1 U7.7(GPIO6(SDMMC1_CK)) U7.B7(GPIO6(SDMMC1_CK))
SD_CMD: R31.1 R95.1 U7.6(GPIO5(SDMMC1_CMD)) U7.B6(GPIO5(SDMMC1_CMD))
SD_DAT0: R33.1 R94.1 U7.5(GPIO4(SDMMC1_D0)) U7.B5(GPIO4(SDMMC1_D0))
SD_DAT1: R34.1 R93.1 U7.4(GPIO3(SDMMC1_D1)) U7.B4(GPIO3(SDMMC1_D1))
SD_DAT2: R29.1 R97.1 U7.3(GPIO2(SDMMC1_D2)) U7.B3(GPIO2(SDMMC1_D2))
SD_DAT3: R30.1 R96.1 U7.2(GPIO1(SDMMC1_D3)) U7.B2(GPIO1(SDMMC1_D3))
SPI6_CLK: U2.29(GPIO22(ADC7/DAC2)) U2.B29(GPIO22(ADC7/DAC2)) U3.29(GPIO22(ADC7/DAC2)) U3.B29(GPIO22(ADC7/DAC2)) U4.29(GPIO22(ADC7/DAC2)) U4.B29(GPIO22(ADC7/DAC2)) U5.29(GPIO22(ADC7/DAC2)) U5.B29(GPIO22(ADC7/DAC2)) U6.29(GPIO22(ADC7/DAC2)) U6.B29(GPIO22(ADC7/DAC2)) U7.29(GPIO22(ADC7/DAC2)) U7.B29(GPIO22(ADC7/DAC2)) U8.29(GPIO22(ADC7/DAC2)) U8.B29(GPIO22(ADC7/DAC2)) U9.29(GPIO22(ADC7/DAC2)) U9.B29(GPIO22(ADC7/DAC2)) U10.29(GPIO22(ADC7/DAC2)) U10.B29(GPIO22(ADC7/DAC2)) U11.29(GPIO22(ADC7/DAC2)) U11.B29(GPIO22(ADC7/DAC2)) X1.6
SPI6_MOSI: U2.25(GPIO18(ADC3)) U2.B25(GPIO18(ADC3)) U3.25(GPIO18(ADC3)) U3.B25(GPIO18(ADC3)) U4.25(GPIO18(ADC3)) U4.B25(GPIO18(ADC3)) U5.25(GPIO18(ADC3)) U5.B25(GPIO18(ADC3)) U6.25(GPIO18(ADC3)) U6.B25(GPIO18(ADC3)) U7.25(GPIO18(ADC3)) U7.B25(GPIO18(ADC3)) U8.25(GPIO18(ADC3)) U8.B25(GPIO18(ADC3)) U9.25(GPIO18(ADC3)) U9.B25(GPIO18(ADC3)) U10.25(GPIO18(ADC3)) U10.B25(GPIO18(ADC3)) U11.25(GPIO18(ADC3)) U11.B25(GPIO18(ADC3)) X1.8
SPI6_NSS: U2.30(GPIO23(ADC8/DAC1)) U2.B30(GPIO23(ADC8/DAC1)) U3.30(GPIO23(ADC8/DAC1)) U3.B30(GPIO23(ADC8/DAC1)) U4.30(GPIO23(ADC8/DAC1)) U4.B30(GPIO23(ADC8/DAC1)) U5.30(GPIO23(ADC8/DAC1)) U5.B30(GPIO23(ADC8/DAC1)) U6.30(GPIO23(ADC8/DAC1)) U6.B30(GPIO23(ADC8/DAC1)) U7.30(GPIO23(ADC8/DAC1)) U7.B30(GPIO23(ADC8/DAC1)) U8.30(GPIO23(ADC8/DAC1)) U8.B30(GPIO23(ADC8/DAC1)) U9.30(GPIO23(ADC8/DAC1)) U9.B30(GPIO23(ADC8/DAC1)) U10.30(GPIO23(ADC8/DAC1)) U10.B30(GPIO23(ADC8/DAC1)) U11.30(GPIO23(ADC8/DAC1)) U11.B30(GPIO23(ADC8/DAC1)) X1.5
SS_2: U2.8(GPIO7(SPI1_NSS)) U2.B8(GPIO7(SPI1_NSS)) U3.8(GPIO7(SPI1_NSS)) U3.B8(GPIO7(SPI1_NSS)) U4.8(GPIO7(SPI1_NSS)) U4.B8(GPIO7(SPI1_NSS)) U5.8(GPIO7(SPI1_NSS)) U5.B8(GPIO7(SPI1_NSS)) U6.8(GPIO7(SPI1_NSS)) U6.B8(GPIO7(SPI1_NSS)) U7.8(GPIO7(SPI1_NSS)) U7.B8(GPIO7(SPI1_NSS)) U8.8(GPIO7(SPI1_NSS)) U8.B8(GPIO7(SPI1_NSS)) U9.8(GPIO7(SPI1_NSS)) U9.B8(GPIO7(SPI1_NSS)) U10.8(GPIO7(SPI1_NSS)) U10.B8(GPIO7(SPI1_NSS)) U11.8(GPIO7(SPI1_NSS)) U11.B8(GPIO7(SPI1_NSS)) X1.9
Unconnected: PS1.3(NC) PS1.5(NC) X1.7 X1.13 X1.14 X1.15 X1.16

### Notes on the sheet
- 011 | 100
- 000 | 001 | 010 | 101 | 011 | 100
- 010 | 101
- Audio

## Sheet 2 of 2

## Library data of the parts
C15 C30 = rcl:C-US: CAPACITOR, American symbol; PARTNO: CC0603KRX7R8BB104
C16 = adafruit:CPOL-US: POLARIZED CAPACITOR, American symbol; PARTNO: EEE-1CA220NP
C20 = rcl:C-US: CAPACITOR, American symbol; PARTNO: CC0603JRNPO9BN220; SPICEPREFIX: C
C21-C27 C29 C31 C32 = rcl:C-EU: CAPACITOR, European symbol; PARTNO: TMK316F106ZL-T
J1 = OPL_Connector:GROVE-CONNECTOR-DIP(4P-2.0): 320110033; PARTNO: 110990030
J2 = 105162-0001:105162-0001: Memory Card Connectors 1.45H MICRO SD HEADER WITH D/C PIN Source: Datasheet <http://www.molex.com/webdocs/datasheets/pdf/en-us//1051620001_MEMORY_CARD_SOCKET.pdf> Check prices <https://pricing.snapeda.com/parts/1051620001/Molex/view-part?ref=eda>; AVAILABILITY: In Stock; DESCRIPTION: 9 (8 + 1) Position Card Connector Secure Digital - microSD™ Surface Mount, Right Angle Gold; MF: Molex; MP: 1051620001; PACKAGE: None; PARTNO: 105162-0001; PRICE: None; PURCHASE-URL: https://pricing.snapeda.com/search/part/1051620001/?ref=eda
JP12 = Connector:PINHD-1X2: PIN HEADER; CATEGORY: CONNECTOR; PARTNO: *DNP; SUB-CATEGORY: PIN-HEADER
L1 = Electrosmith-Passives:INDUCTOR; PARTNO: SRP2010-2R2M
PS1 = UWE1215S-3WR3:UWE1215S-3WR3: DC/DC Converter; DESCRIPTION: Isolated Module DC DC Converter 2 Output 15V -15V - - 100mA, 100mA 4.5V - 36V Input; DIGI-KEY_PART_NUMBER: 2725-UWE1215S-3WR3-ND; MF: Mornsun America, LLC; MP: UWE1215S-3WR3; PACKAGE: SIP-7-7 MORNSUN; PARTNO: UWE1215S-3WR3; PURCHASE-URL: https://pricing.snapeda.com/search/part/UWE1215S-3WR3/?ref=eda
R1 R2 R8 R13 R16 R19 R22 = Resistor:R-US_: RESISTOR, American symbol; PARTNO: ESR03EZPF1002
R3 = Resistor:R-US_: RESISTOR, American symbol; PARTNO: ESR03EZPF5600
R5 = Resistor:R-US_: RESISTOR, American symbol; PARTNO: ESR03EZPJ473
R6 R7 R9 R12 R14 R15 R17 R18 R20 R21 R23 R56 = Electrosmith-Passives:R-US_: RESISTOR, American symbol; PACKAGE: R0603; PARTNO: RMCF0603FT2M00
R24 R25 = rcl:R-US_: RESISTOR, American symbol; PARTNO: ERJ-PA3F2001V; SPICEPREFIX: R
R27 R29-R34 = rcl:R-US_: RESISTOR, American symbol; PARTNO: RC0603JR-0747RL; SPICEPREFIX: R
R93-R97 = rcl:R-US_: RESISTOR, American symbol; PARTNO: ESR03EZPJ473
S1 = switch-omron:10-XX: OMRON SWITCH; MPN: B3F-1000; OC_FARNELL: 176432; OC_NEWARK: 36M3542
U1 = OPA1611AID:OPA1611AID; DESCRIPTION: 1.1nV/√Hz Noise, Low Power, Precision Operational Amplifier; DIGI-KEY_PART_NUMBER: 296-24958-5-ND; MF: Texas Instruments; MP: OPA1611AID; PACKAGE: SOIC-8 Texas Instruments; PARTNO: OPA1611AID; PURCHASE-URL: https://pricing.snapeda.com/search/part/OPA1611AID/?ref=eda
U2-U11 = Electrosmith_Boards:ES_DAISY_SEED; PARTNO: 4840-6004-CP
X1 = con-3m:2516-: 3M (TM) Pak 100 4-Wall Header Source: 3M; OC_FARNELL: unknown; OC_NEWARK: unknown; PARTNO: SBH11-PBPC-D08-ST-BK

## Board
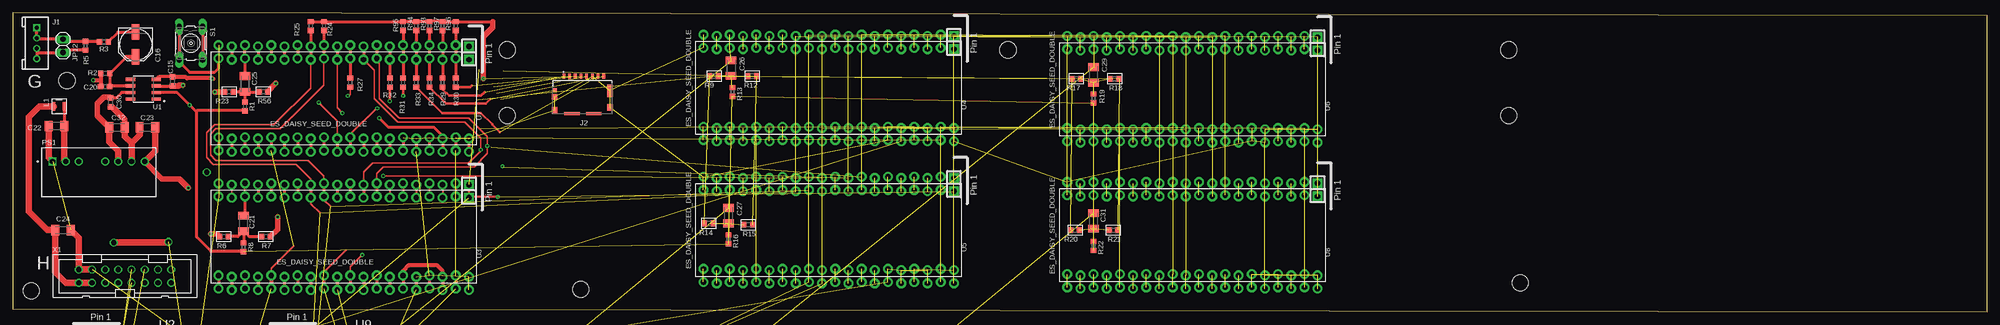
[diagram p3: board, top side]
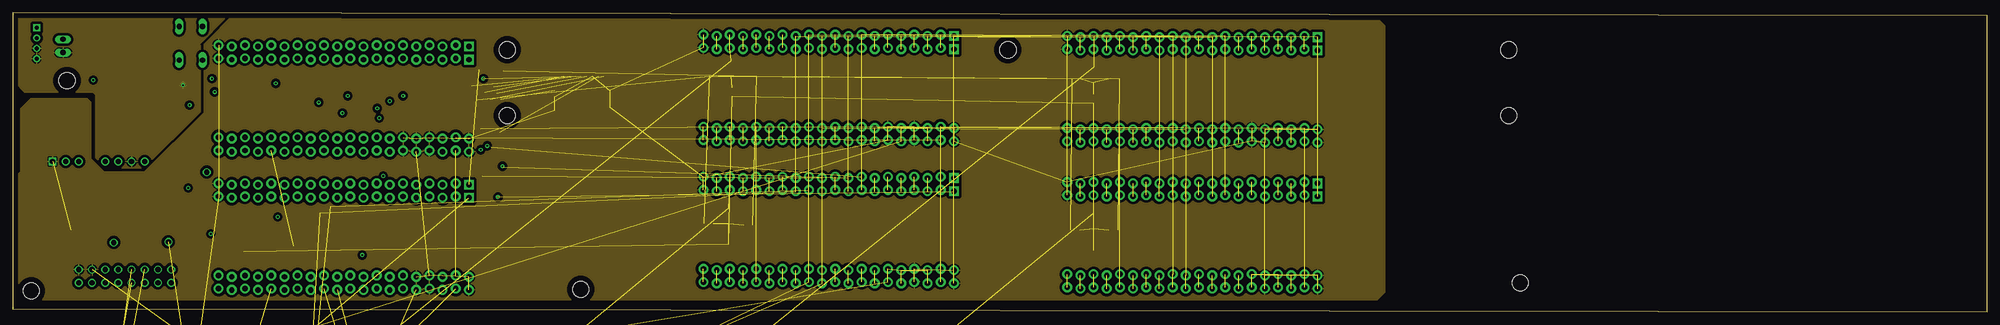
[diagram p4: board, inner layer Route2]
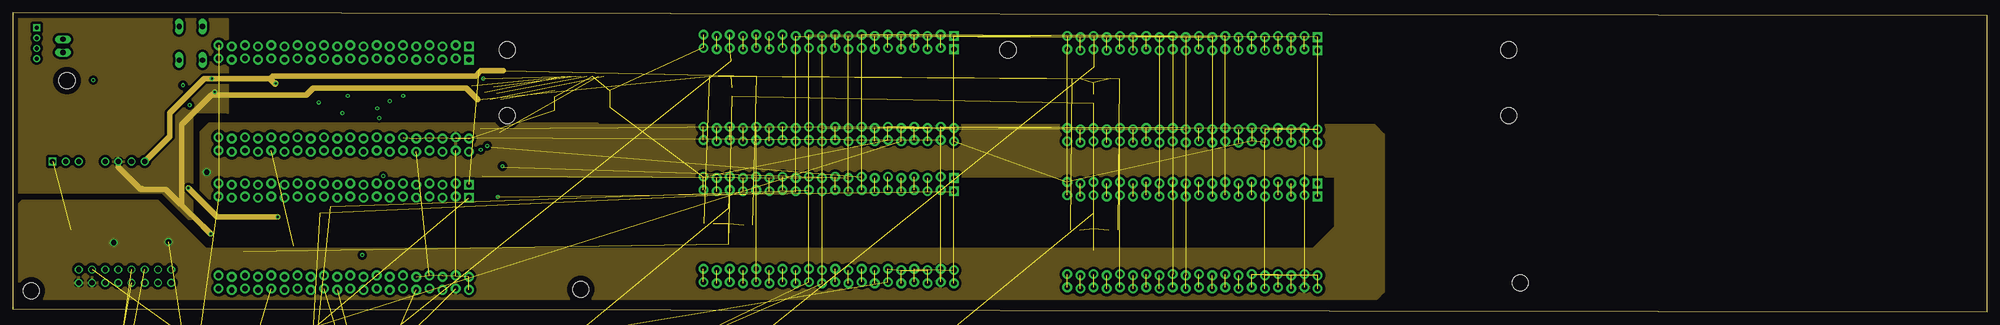
[diagram p5: board, inner layer Route15]
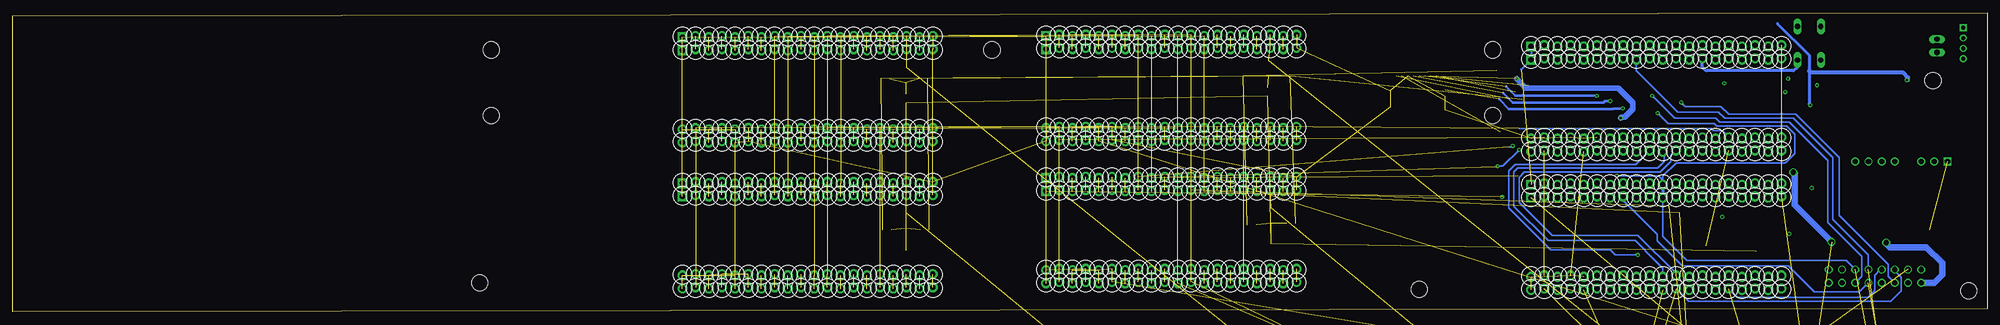
[diagram p6: board, bottom side, seen from below]

Size 380.49 x 57.66 mm. Coordinates in mm from the lower left corner, seen from the top.
Outline: 0,57.66 0,0.51 380.49,0 380.49,57.15 0,57.66
Copper layers (1+2*15+16): Top 0.035mm / dielectric 0.5mm / Route2 0.035mm / dielectric 0.5mm / Route15 0.035mm / dielectric 0.5mm / Bottom 0.035mm
Design rules "default *": minimum track width 6mil, minimum drill 13mil, track to track 9mil, track to pad 9mil, pad to pad 9mil, via to via 9mil, smd to smd 9mil, copper to edge 40mil, drill to drill 6mil, minimum pad ring 10mil, minimum via ring 8mil, stop-mask expansion 4mil, vias tented up to drill 0mil, thermal gap 10mil
Holes 3.17 mm at 95.25,37.85 288.29,37.85 10.41,44.58 290.53,5.56 109.42,4.29 3.51,4.04 288.29,50.55 191.77,50.55 95.25,50.55

### Footprints (pad centres in the part's own frame; a part is rotated, then mirrored left to right if it is on the bottom)
C0603K = smd 1.05 x 1.08: 1 -0.875,0; 2 0.875,0
PANASONIC_D = smd 3 x 1.4: + 2.4,0; - -2.4,0
C0603 = smd 1.1 x 1: 1 -0.85,0; 2 0.85,0
C1206K = smd 1.5 x 2: 1 -1.5,0; 2 1.5,0
HW4-2.0 = drill 0.8 pad 1.27 square: 1 -3,0 | drill 0.8 pad 1.27: 2 -1,0; 3 1,0; 4 3,0
105162-0001 = smd 0.5 x 1: 1 3.55,-7.34; 2 2.45,-7.34; 3 1.35,-7.34; 4 0.25,-7.34; 5 -0.85,-7.34; 6 -1.95,-7.34; 7 -3.05,-7.34; 8 -4.15,-7.34 | smd 0.72 x 0.78: 9 5.31,-4.66 | smd 1.05 x 1.08: 10 5.325,-3.39 | smd 1.05 x 1.2: 11 5.325,-0.78; 12 -5.325,-1.35 | smd 1.05 x 2.39: 13 -5.325,-4.535 | smd 2.91 x 0.55: 14 1.986,-0.105; 15 -2.204,-0.105
1X02 = drill 1.016 long: 1 -1.27,0; 2 1.27,0
BOURNS_SRP2010 = smd 0.559 x 1.6: P$1 -1.003,0; P$2 1.003,0
CONV_UWE1215S-3WR3 = drill 1 square: 1 -8.89,2.05 | drill 1: 2 -6.35,2.05; 3 -3.81,2.05; 5 1.27,2.05; 6 3.81,2.05; 7 6.35,2.05; 8 8.89,2.05
R0603 = smd 1 x 1.1: 1 -0.85,0; 2 0.85,0
B3F-10XX = drill 1.016 long: 1 -3.251,2.261; 2 3.251,2.261; 3 -3.251,-2.261; 4 3.251,-2.261
SOIC127P599X175-8N = smd 1.97 x 0.6: 1 -2.47,1.905; 2 -2.47,0.635; 3 -2.47,-0.635; 4 -2.47,-1.905; 5 2.47,-1.905; 6 2.47,-0.635; 7 2.47,0.635; 8 2.47,1.905
ES_DAISY_SEED_DOUBLE = drill 1.016 pad 1.88 square: 1 -7.493,24.13; B1 -10.033,24.13 | drill 1.016 pad 1.88: 2 -7.747,21.59; 3 -7.493,19.05; 4 -7.747,16.51; 5 -7.493,13.97; 6 -7.747,11.43; 7 -7.493,8.89; 8 -7.747,6.35; 9 -7.493,3.81; 10 -7.747,1.27; 11 -7.493,-1.27; 12 -7.747,-3.81; 13 -7.493,-6.35; 14 -7.747,-8.89; 15 -7.493,-11.43; 16 -7.747,-13.97; 17 -7.493,-16.51; 18 -7.747,-19.05; 19 -7.493,-21.59; 20 -7.747,-24.13; 21 7.493,-24.13; 22 7.747,-21.59; 23 7.493,-19.05; 24 7.747,-16.51; 25 7.493,-13.97; 26 7.747,-11.43; 27 7.493,-8.89; 28 7.747,-6.35; 29 7.493,-3.81; 30 7.747,-1.27; 31 7.493,1.27; 32 7.747,3.81; 33 7.493,6.35; 34 7.747,8.89; 35 7.493,11.43; 36 7.747,13.97; 37 7.493,16.51; 38 7.747,19.05; 39 7.493,21.59; 40 7.747,24.13; B2 -10.287,21.59; B3 -10.033,19.05; B4 -10.287,16.51; B5 -10.033,13.97; B6 -10.287,11.43; B7 -10.033,8.89; B8 -10.287,6.35; B9 -10.033,3.81; B10 -10.287,1.27; B11 -10.033,-1.27; B12 -10.287,-3.81; B13 -10.033,-6.35; B14 -10.287,-8.89; B15 -10.033,-11.43; B16 -10.287,-13.97; B17 -10.033,-16.51; B18 -10.287,-19.05; B19 -10.033,-21.59; B20 -10.287,-24.13; B21 10.033,-24.13; B22 10.287,-21.59; B23 10.033,-19.05; B24 10.287,-16.51; B25 10.033,-13.97; B26 10.287,-11.43; B27 10.033,-8.89; B28 10.287,-6.35; B29 10.033,-3.81; B30 10.287,-1.27; B31 10.033,1.27; B32 10.287,3.81; B33 10.033,6.35; B34 10.287,8.89; B35 10.033,11.43; B36 10.287,13.97; B37 10.033,16.51; B38 10.287,19.05; B39 10.033,21.59; B40 10.287,24.13
PAK100/2500-16 = drill 1 pad 1.422: 1 -8.89,-1.27; 2 -8.89,1.27; 3 -6.35,-1.27; 4 -6.35,1.27; 5 -3.81,-1.27; 6 -3.81,1.27; 7 -1.27,-1.27; 8 -1.27,1.27; 9 1.27,-1.27; 10 1.27,1.27; 11 3.81,-1.27; 12 3.81,1.27; 13 6.35,-1.27; 14 6.35,1.27; 15 8.89,-1.27; 16 8.89,1.27

### Placement (x,y rotation side)
C15  30.73,44.45 90 top
C16  23.62,51.56 270 top
C20  17.78,43.43 0 top
C21  44.45,17.02 270 top
C22  8.38,35.81 180 top
C23  25.91,35.56 0 top
C24  9.65,15.75 0 top
C25  44.7,43.94 270 top
C26  138.43,46.99 270 top
C27  137.92,18.54 270 top
C29  208.28,45.72 270 top
C30  18.8,40.39 270 top
C31  208.28,17.53 270 top
C32  20.07,35.56 0 top
J1  4.57,51.82 270 top
J2  109.73,38.1 180 top
JP12  9.65,51.31 270 top
L1  8.89,39.62 0 top
PS1  16.51,26.92 0 top
R1  44.7,39.62 270 top
R2  17.78,45.97 0 top
R3  17.53,52.07 180 top
R5  13.97,51.31 90 top
R6  40.64,14.48 180 top
R7  48.77,14.48 180 top
R8  44.45,12.45 270 top
R9  135.13,45.47 180 top
R12  142.49,45.47 180 top
R13  138.68,42.42 270 top
R14  134.11,17.02 180 top
R15  141.73,16.76 180 top
R16  137.92,13.97 270 top
R17  204.98,44.96 180 top
R18  212.34,44.96 180 top
R19  208.28,41.15 270 top
R20  204.72,15.75 180 top
R21  212.09,15.75 180 top
R22  208.28,12.7 270 top
R23  41.66,42.42 180 top
R24  59.94,55.12 270 top
R25  57.4,55.12 270 top
R27  65.02,44.2 270 top
R29  82.8,44.2 270 top
R30  85.34,44.2 270 top
R31  75.18,44.2 270 top
R32  72.64,44.2 270 top
R33  77.72,44.2 270 top
R34  80.26,44.2 270 top
R56  48.26,42.42 180 top
R93  80.26,55.12 90 top
R94  77.72,55.12 90 top
R95  75.18,55.12 90 top
R96  85.34,55.12 90 top
R97  82.8,55.12 90 top
S1  34.29,51.82 270 top
U1  25.15,42.93 180 top
U2  25.65,-28.96 0 top  (outside the outline)
U3  63.75,14.48 270 top
U4  157.23,43.18 270 top
U5  157.23,15.75 270 top
U6  227.33,42.93 270 top
U7  63.75,41.15 270 top
U8  227.33,14.73 270 top
U9  63.5,-28.96 0 top  (outside the outline)
U10  25.65,-87.38 0 top  (outside the outline)
U11  63.5,-87.38 0 top  (outside the outline)
X1  21.59,6.86 0 top

### Tracks (layer width: path | path; a pad name or v marks a point on that pad's centre or on a via)
+3V3  (via drill 0.35)  (1 unrouted)
  Top 0.61: R25.1 R24.1 R95.2 R94.2 R93.2 80.43,56.13 82.64,56.13 R97.2 R96.2 92.46,55.97 | U7.B38 U7.38 82.8,33.91 81.15,35.56 72.39,35.56 v70.61,37.34
  Top 1.016: 92.46,55.97 92.46,54.86 90.68,53.09 v90.68,44.96
  Bottom 1.016: v70.61,37.34 70.36,37.59 69.85,37.59 68.33,39.12 68.33,40.39 71.12,43.18 88.9,43.18 v90.68,44.96
+12V  (via drill 1)  (18 unrouted)
  Top 0.61: U7.39 U7.B39 | U3.39 U3.B39
  Top 1.27: L1.P$1 5.08,39.62 3.05,37.59 3.05,19.3 6.6,15.75 C24.1 8.15,7.64 8.13,7.62 10.16,5.59 X1.1 X1.3 | v19.43,13.34 29.84,13.34 v29.97,13.46
  Bottom 1.27: X1.1 10.16,5.59 8.64,7.11 8.64,9.4 11.68,12.45 18.8,12.45 19.56,13.21 v19.43,13.34 | v29.97,13.46 37.08,20.57 37.08,26.67 v37.34,26.92
  pour Route15 (isolate 0.508): 1.78,21.34 27.94,21.34 37.13,12.14 250.65,12.14 254.97,16.46 254.97,26.11 38.66,26.11 38.66,22.15 38.1,21.59 36.32,23.37 36.32,34.8 37.85,36.32 112.52,36.32 112.82,36.02 262.33,36.02 264.16,34.19 264.16,3.81 262.84,2.49 0.56,2.49 0.51,2.54 0.51,20.07
+15V  (via drill 0.35)  (4 unrouted)
  Top 0.61: U1.7 20.95,42.29 19.93,41.26 C30.1
  Top 1.016: v38.1,14.99 39.28,14.99 R6.2 | v38.86,42.42 R23.2 | C32.1 16.26,37.87 16.26,40.13 17.53,41.4 18.66,41.4 C30.1
  Top 1.27: C32.1 18.57,32.74 20.32,30.99 PS1.6
  Route15 1.016: PS1.6 20.32,27.96 24.65,23.63 24.77,23.76 24.91,23.62 29.46,23.62 32.38,20.7 | 32.38,20.7 36.58,16.51 v38.1,14.99 | 32.38,20.7 32.51,20.83 32.51,36.07 38.23,41.78 | 38.23,41.78 v38.86,42.42 | 38.23,41.78 56.52,41.78 57.91,43.18 87.38,43.18 89.6,40.96
  pour Route15 (isolate 0.508): 0.76,57.15 0.76,23.11 28.7,23.11 33.78,18.03 34.54,18.03 34.54,38.61 41.15,38.61 41.4,38.35 41.4,56.39 1.52,56.39
-15V  (via drill 0.35)  (4 unrouted)
  Top 0.61: C15.2 28.11,45.33 U1.4
  Top 0.813: C15.2 33.27,45.33 33.53,45.07 38.49,45.07 38.61,44.96 v38.35,44.96
  Top 1.016: v50.67,44.07 49.11,42.51 R56.1 | PS1.8 28.72,25.65 32,25.65 v33.78,23.88 | v51.05,18.29 51.05,15.91 R7.1
  Top 1.27: C23.2 27.41,30.98 PS1.8
  Route15 1.016: PS1.8 30.23,33.8 30.23,38.35 36.83,44.96 v38.35,44.96 49.53,44.96 | 49.53,44.96 50.55,43.94 v50.67,44.07 | 49.53,44.96 50.04,45.47 89.15,45.47 90.17,46.48 94.49,46.48 | v33.78,23.88 39.37,18.29 v51.05,18.29
CLK  (via drill 0.35)  (1 unrouted)
  Top 0.508: R32.2 v72.64,40.64
  Bottom 0.508: v72.64,40.64 73.66,40.64 73.91,40.39 91.44,40.39 93.22,42.16
CMD  (via drill 0.35)  (1 unrouted)
  Top 0.508: R31.2 v75.18,41.66
  Bottom 0.508: v75.18,41.66 90.93,41.66 92.71,43.43
DAT0  (1 unrouted)
  Top 0.508: R33.2 82.72,38.35 90.17,38.35 92.34,36.18 92.34,36.13 93.79,34.68
DAT1  (1 unrouted)
  Top 0.508: R34.2 83.48,40.13 91.14,40.13 92.01,41.01
DAT2  (1 unrouted)
  Top 0.508: R29.2 82.8,42.84 83.48,42.16 83.57,42.16 84.07,41.66 90.17,41.66 90.93,42.42
DAT3  (1 unrouted)
  Top 0.508: R30.2 88.14,43.35 88.39,43.6
DGND4  (74 unrouted)
  Top 0.61: U7.35 U7.B35 | U7.36 U7.B36 | U7.37 U7.B37 | U7.40 U7.B40 | U3.37 U3.B37 | U3.36 U3.B36 | S1.3 S1.4 32.03,48.23 34.04,46.23 38.86,46.23 39.62,46.99 U7.20
  Top 1.27: C22.2 6.88,29.71 PS1.1 | C24.2 12.7,14.2 X1.2 X1.4
  pour Route2 (isolate 0.508): 1.52,26.92 1.52,39.12 3.56,41.15 14.22,41.15 14.99,40.39 14.99,29.46 17.53,26.92 25.4,26.92 36.83,38.35 36.83,51.56 42.93,57.66 261.87,57.66 264.41,55.12 264.41,3.81 262.89,2.29 0.25,2.29 0.25,25.65
GNDINT  (via drill 0.35)
  Top 0.61: U1.3 27.63,43.58 C15.1 | R5.1 10.07,50.46 JP12.2 4.84,50.04 4.57,50.31 J1.3 J1.4
  Top 1.016: C30.2 19.16,39.51 21.59,37.08 21.59,35.58 C32.2 | C15.1 31.89,43.58 32,43.69 v32.77,43.69
  Top 1.27: C32.2 21.57,33.81 22.86,32.51 | 22.86,32.51 PS1.7 | C23.1 24.41,34.06 22.86,32.51
  pour Route2 (isolate 0.508): 18.03,27.69 25.15,27.69 36.07,38.61 36.07,51.31 35.81,51.56 41.15,56.9 41.15,57.15 0.76,57.15 0.51,56.9 0.51,44.2 2.29,42.42 15.49,42.42 16,41.91 16,29.72
I2C_SCL  (16 unrouted)
  Top 0.305: 61.21,20.32 59.94,21.59 U3.12 | U7.12 59.94,43.69 51.56,35.31 39.12,35.31 38.1,34.29 38.1,30.23 39.12,29.21 56.9,29.21 59.94,26.16 U3.B12
  Top 0.61: R24.2 U7.B12 U7.12 | U3.B12 U3.12
I2C_SDA  (16 unrouted)
  Top 0.305: U3.13 57.4,20.83 59.18,19.05 | U7.13 57.4,43.18 50.29,36.07 38.86,36.07 37.34,34.54 37.34,29.72 38.61,28.45 54.61,28.45 57.4,25.65 U3.B13
  Top 0.61: R25.2 U7.B13 U7.13 | U3.B13 U3.13
MASTER_SIGNAL  (via drill 0.35)  (17 unrouted)
  Top 0.406: v93.47,22.1 88.01,22.1 | 88.01,22.1 U3.1 | U3.B1 87.88,22.22 88.01,22.1
  Bottom 0.406: U7.B1 U7.1 89.79,46.74
MISO_2
  Top 0.61: R27.1 U7.10 U7.B10
MISO_2_P1
  Top 0.61: U3.B10 U3.10
MISO_2_P2  (1 unrouted)
MISO_2_P3  (1 unrouted)
MISO_2_P4  (1 unrouted)
MISO_2_P5  (1 unrouted)
MISO_2_P6  (1 unrouted)
MISO_2_P7  (1 unrouted)
MISO_2_P8  (1 unrouted)
MISO_2_P9  (1 unrouted)
MONO_OUTPUT
  Top 0.61: 18.76,43.56 18.63,43.69 R2.2 21.82,49.16 | U1.6 18.76,43.56 | 18.76,43.56 C20.2
  Top 0.813: C16.+ 21.82,49.16
MOSI_2  (via drill 0.35)  (16 unrouted)
  Top 0.305: U7.11 62.48,39.37 v63.5,38.35 | 90.42,26.16 v71.37,26.16
  Top 0.61: U7.B11 U7.11 | U3.B11 U3.11
  Bottom 0.305: X1.12 27.18,9.91 57.91,9.91 62.48,14.48 U3.11 | v63.5,38.35 61.47,36.32 52.58,36.32 52.07,35.81 38.61,35.81 37.08,34.29 37.08,30.48 38.86,28.7 59.94,28.7 62.48,26.16 62.48,25.4 | 62.48,25.4 62.48,23.88 | v71.37,26.16 63.25,26.16 62.48,25.4
  Bottom 0.61: U3.B11 62.48,23.88 U3.11
N$1  (1 unrouted)
N$2
  Top 0.305: C21.2 45.49,14.48
  Top 0.61: R8.1 C21.2 43.41,14.48 R6.1 | 45.49,14.48 R7.2
N$3  (1 unrouted)
N$4  (via drill 0.35)  (4 unrouted)
  Top 0.61: R1.2 35.39,38.77 35.39,38.52 | U1.2 31.62,42.29 v34.04,39.88 35.39,38.52 | R8.2 38.19,11.6 35.39,14.39 35.39,38.52
  Top 0.813: R2.1 16.93,44.7 | 16.93,44.7 C20.1 | v15.49,44.7 16.93,44.7
  Bottom 0.61: 40.39,55.63 34.29,49.53 34.29,46.48 34.29,40.13 v34.04,39.88
  Bottom 0.813: 34.29,46.48 34.04,46.23 16.26,46.23 15.24,45.21 15.24,44.7 v15.49,44.7
N$5
  Top 0.61: R3.1 20.27,53.96 C16.-
N$6
  Top 0.61: R3.2 14.06,52.07 R5.2 10.07,52.16 JP12.1 4.81,52.58 J1.2 J1.1
N$7
  Top 0.61: C25.2 R1.1 | C25.2 44.73,42.42 R56.2 | C25.2 44.68,42.42 R23.1
N$8  (3 unrouted)
N$9  (3 unrouted)
N$10  (3 unrouted)
N$11  (3 unrouted)
N$12
  Top 0.61: U7.B19 U7.19
N$13
  Top 0.61: U7.B17 U7.17
N$14
  Top 0.61: U7.B16 U7.16
N$15
  Top 0.61: U7.B15 U7.15
N$16  (1 unrouted)
N$17  (1 unrouted)
N$18  (1 unrouted)
N$19  (1 unrouted)
N$20
  Top 0.61: U7.34 U7.B34
N$21
  Top 0.61: U7.33 U7.B33
N$22
  Top 0.61: U7.32 U7.B32
N$23  (1 unrouted)
N$24  (via drill 0.35)
  Top 0.305: R27.2 65.02,41.91 64.77,41.66 v64.52,41.66
  Bottom 0.305: v64.52,41.66 60.2,37.34 52.32,37.34 51.56,36.58 38.1,36.58 30.73,29.21 30.73,17.27 24.13,10.67 24.13,6.86 X1.11
N$25
  Top 0.61: U7.28 U7.B28
N$26
  Top 0.61: U7.27 U7.B27
N$27  (1 unrouted)
N$28
  Top 0.61: U3.26 U3.B26
N$29
  Top 0.61: U3.21 U3.B21
N$30
  Top 0.61: U7.24 U7.B24
N$31
  Top 0.61: U7.23 U7.B23
N$32
  Top 0.61: U7.22 U7.B22
N$33
  Top 0.305: U3.B19 U3.19
N$34
  Top 0.61: U3.B17 U3.17
N$35
  Top 0.61: U3.B16 U3.16
N$36
  Top 0.61: U3.B15 U3.15
N$37
  Top 0.61: U3.B14 U3.14
N$38
  Top 0.61: U7.26 U7.B26
N$39
  Top 0.61: U3.38 U3.B38 | U3.35 U3.B35
  Top 0.813: U3.38 82.8,7.87 81.79,8.89 76.2,8.89 75.18,7.87 U3.35
N$40
  Top 0.61: U3.34 U3.B34
N$41
  Top 0.61: U3.33 U3.B33
N$42
  Top 0.61: U3.32 U3.B32
N$43
  Top 0.61: U3.28 U3.B28
N$44
  Top 0.61: U3.27 U3.B27
N$45
  Top 0.61: U7.21 U7.B21
N$46
  Top 0.61: U3.24 U3.B24
N$47
  Top 0.61: U3.23 U3.B23
N$48
  Top 0.61: U3.22 U3.B22
N$49  (1 unrouted)
N$50  (1 unrouted)
N$51  (1 unrouted)
N$52  (1 unrouted)
N$53  (1 unrouted)
N$54  (1 unrouted)
N$55
  Top 0.61: U7.B14 U7.14 | S1.1 S1.2
  Bottom 0.61: S1.2 36.58,48.54 36.58,47.24 37.34,46.48 54.1,46.48 54.86,47.24 U7.14
N$56
  Top 0.406: U3.B2 U3.2
N$57  (1 unrouted)
N$58  (1 unrouted)
N$59  (1 unrouted)
N$60  (1 unrouted)
N$61  (1 unrouted)
N$62  (1 unrouted)
N$63  (1 unrouted)
N$64  (1 unrouted)
N$65  (1 unrouted)
N$66  (1 unrouted)
N$67  (1 unrouted)
N$68  (1 unrouted)
N$69  (1 unrouted)
N$70  (1 unrouted)
N$71
  Top 0.406: U3.B3 U3.3
N$72
  Top 0.406: U3.B4 U3.4
N$73  (1 unrouted)
N$74  (1 unrouted)
N$75  (1 unrouted)
N$76  (1 unrouted)
N$77  (1 unrouted)
N$78  (1 unrouted)
N$79  (1 unrouted)
N$80  (1 unrouted)
N$81
  Top 0.61: L1.P$2 9.89,35.83 C22.1
  Top 1.27: C22.1 9.88,29.25 PS1.2
N$82  (1 unrouted)
N$83  (1 unrouted)
N$84  (1 unrouted)
N$85  (1 unrouted)
N$86  (1 unrouted)
N$87  (1 unrouted)
N$88  (3 unrouted)
N$89
  Top 0.406: U3.B5 U3.5
N$90  (1 unrouted)
N$91  (1 unrouted)
N$92  (1 unrouted)
N$93  (1 unrouted)
N$94  (1 unrouted)
N$95  (1 unrouted)
N$96  (1 unrouted)
N$97  (1 unrouted)
N$98  (1 unrouted)
N$99  (1 unrouted)
N$100  (1 unrouted)
N$101  (1 unrouted)
N$102  (1 unrouted)
N$103  (1 unrouted)
N$104  (5 unrouted)
N$105
  Top 0.406: U3.B6 U3.6
N$106
  Top 0.406: U3.B7 U3.7
N$107  (1 unrouted)
N$108  (1 unrouted)
N$109  (1 unrouted)
N$110  (1 unrouted)
N$111  (1 unrouted)
N$112  (1 unrouted)
N$113  (1 unrouted)
N$114  (1 unrouted)
N$115  (1 unrouted)
N$116  (1 unrouted)
N$117  (1 unrouted)
N$118  (1 unrouted)
N$119  (1 unrouted)
N$120  (1 unrouted)
N$121  (1 unrouted)
N$122  (1 unrouted)
N$123  (1 unrouted)
N$124  (1 unrouted)
N$125  (1 unrouted)
N$126  (1 unrouted)
N$127  (1 unrouted)
N$128  (1 unrouted)
N$129  (1 unrouted)
N$130  (1 unrouted)
N$131  (1 unrouted)
N$132  (1 unrouted)
N$133  (1 unrouted)
N$134  (1 unrouted)
N$135  (1 unrouted)
N$136  (1 unrouted)
N$137  (1 unrouted)
N$138  (1 unrouted)
N$139  (1 unrouted)
N$140  (1 unrouted)
N$141  (1 unrouted)
N$142  (1 unrouted)
N$143  (1 unrouted)
N$144  (1 unrouted)
N$145  (1 unrouted)
N$146  (1 unrouted)
N$147  (1 unrouted)
N$148  (1 unrouted)
N$149  (1 unrouted)
N$150  (1 unrouted)
N$151  (1 unrouted)
N$152  (1 unrouted)
N$153  (1 unrouted)
N$154  (1 unrouted)
N$155  (1 unrouted)
N$156  (1 unrouted)
N$157  (1 unrouted)
N$158  (1 unrouted)
N$159  (1 unrouted)
N$160  (1 unrouted)
N$161  (1 unrouted)
N$162  (1 unrouted)
N$163  (1 unrouted)
N$164  (1 unrouted)
N$165  (1 unrouted)
N$166  (1 unrouted)
N$167  (1 unrouted)
N$168  (1 unrouted)
N$169  (1 unrouted)
N$170  (1 unrouted)
N$171  (1 unrouted)
N$172  (3 unrouted)
N$173  (1 unrouted)
N$174  (1 unrouted)
N$175  (1 unrouted)
N$176  (1 unrouted)
N$177  (1 unrouted)
N$178  (1 unrouted)
N$179  (1 unrouted)
N$180  (1 unrouted)
N$181  (1 unrouted)
N$182  (1 unrouted)
N$183  (1 unrouted)
N$184  (1 unrouted)
N$185  (1 unrouted)
N$186  (1 unrouted)
N$187  (5 unrouted)
N$188  (1 unrouted)
N$189  (1 unrouted)
N$190  (1 unrouted)
N$191  (1 unrouted)
N$192  (1 unrouted)
N$193  (1 unrouted)
N$194  (1 unrouted)
N$195  (1 unrouted)
N$196  (1 unrouted)
N$197  (1 unrouted)
N$198  (1 unrouted)
N$199  (1 unrouted)
N$200  (1 unrouted)
N$201  (1 unrouted)
N$202  (1 unrouted)
N$203  (1 unrouted)
N$204  (1 unrouted)
N$205  (1 unrouted)
N$206  (1 unrouted)
N$207  (1 unrouted)
N$208  (1 unrouted)
N$209  (1 unrouted)
N$210  (1 unrouted)
N$211  (1 unrouted)
N$212  (1 unrouted)
N$213  (1 unrouted)
N$214  (1 unrouted)
N$215  (1 unrouted)
N$216  (1 unrouted)
N$217  (1 unrouted)
N$218  (1 unrouted)
N$219  (1 unrouted)
N$220  (1 unrouted)
N$221  (1 unrouted)
N$222  (1 unrouted)
N$223  (1 unrouted)
N$224  (1 unrouted)
N$225  (1 unrouted)
N$226  (1 unrouted)
OUT1
  Top 0.61: 44.7,48.26 C25.1 | U7.18 U7.B18
  Top 0.813: U7.18 44.7,48.26
OUT2
  Top 0.305: U3.18 U3.B18
  Top 0.61: U3.18 44.7,18.77 C21.1
OUT3  (4 unrouted)
OUT4  (4 unrouted)
OUT5  (4 unrouted)
OUT6  (4 unrouted)
PA1_SD_DETECT  (via drill 0.35)  (1 unrouted)
  Top 0.305: v67.31,10.92 65.02,8.63 U3.31
  Top 0.508: 65.02,34.29 69.98,39.24 v70.23,39.24
  Top 0.61: 65.02,34.29 U7.31 U7.B31 | U3.31 U3.B31
  Bottom 0.305: U7.B31 67.69,28.45 90.93,28.45 92.2,27.18 92.2,20.07 84.07,11.94 72.64,11.94 71.63,10.92 v67.31,10.92
  Bottom 0.508: v70.23,39.24 72.01,39.24 72.14,39.12 92.15,39.12 94.05,41.01
PA1_SD_DETECT1  (1 unrouted)
PA1_SD_DETECT2  (1 unrouted)
PULLUPED  (11 unrouted)
PULLUPED2  (7 unrouted)
SCLK_2  (via drill 0.35)  (16 unrouted)
  Top 0.305: U7.9 69.6,46.61 69.6,41.15 74.17,36.58 87.12,36.58 90.17,33.53 v90.17,31.24 90.17,30.99 87.88,28.7 69.34,28.7 67.56,26.92 U3.B9 | 94.49,27.94 v94.36,28.07
  Top 0.61: U7.B9 U7.9 | U3.B9 U3.9
  Bottom 0.305: X1.10 22.86,10.92 29.72,17.78 29.72,29.72 37.34,37.34 50.59,37.34 51.79,38.53 59.61,38.53 67.56,46.48 U7.9 | v94.36,28.07 93.34,28.07 v90.17,31.24
SD_CLK
  Top 0.61: R32.1 U7.7 U7.B7
SD_CMD
  Top 0.305: U7.B6 U7.6
  Top 0.61: R31.1 U7.6 R95.1
SD_DAT0
  Top 0.61: R33.1 U7.5 U7.B5 R94.1
SD_DAT1
  Top 0.61: R34.1 U7.4 U7.B4 R93.1
SD_DAT2
  Top 0.61: R29.1 U7.3 U7.B3 R97.1
SD_DAT3
  Top 0.61: R30.1 U7.2 U7.B2 R96.1
SPI6_CLK  (16 unrouted)
  Top 0.305: U3.29 59.94,7.62 64.26,11.94
  Top 0.61: U7.29 U7.B29 | U3.29 U3.B29
  Bottom 0.305: X1.6 17.78,7.87 16.51,6.6 16.51,4.06 18.54,2.03 57.53,2.03 U3.B29 | U7.B29 60.96,30.1 60.96,28.96 62.99,26.92 89.15,26.92 90.17,25.91 90.17,21.08 83.82,14.73 67.31,14.73 59.94,7.37 U3.29
SPI6_MOSI  (17 unrouted)
  Top 0.305: U3.25 49.78,8.38 54.1,12.7
  Top 0.61: U7.25 U7.B25
  Top 0.813: U3.25 U3.B25
  Bottom 0.305: U3.B25 48.13,2.79 22.86,2.79 21.65,4 21.65,7.05 20.57,8.13 X1.8 | 90.17,35.31 53.12,35.31 52.74,34.93 51.05,34.93 U7.25
SPI6_NSS  (via drill 0.35)  (16 unrouted)
  Top 0.305: v58.93,40.39 62.48,36.83 U7.30
  Top 0.61: U7.30 U7.B30 | U3.30 U3.B30
  Bottom 0.305: X1.5 19.05,6.86 19.05,9.14 28.45,18.54 28.45,29.72 36.83,38.1 49.78,38.1 51.31,39.62 58.17,39.62 v58.93,40.39 | U3.30 62.48,8.38 64.01,9.91 67.82,13.72 84.59,13.72 91.19,20.31 91.19,26.92 90.42,27.69 63.5,27.69 62.23,28.96 62.23,30.61 U7.B30
SS_2  (via drill 0.35)  (16 unrouted)
  Top 0.305: U7.8 70.61,48.39 70.61,41.15 74.42,37.34 87.88,37.34 91.44,33.78 v91.44,32 91.44,30.48 88.9,27.94 71.37,27.94 70.1,26.67 U3.B8
  Top 0.61: U7.B8 U7.8 | U3.B8 U3.8
  Bottom 0.305: X1.9 24.64,3.81 33.27,3.81 38.28,8.81 58.77,8.81 63.58,13.62 63.58,14.93 70.1,21.46 | 92.2,31.75 91.44,31.75 v91.44,32
  Bottom 0.61: 70.1,21.46 U3.8

### Text on the board
tPlace: G | H